# EasyEDA Pro project ProPrj_PEDRO.epro, schematic Schematic1

## Sheets
1 MCU: Board Name: Board1; Create Date: 2026-08-21; Page Name: MCU; Project Name: PEDRO; Schematic Name: Schematic1; Update Date: 2026-08-27; Company: 嘉立创EDA; Page Size: A3; Version: V1.0
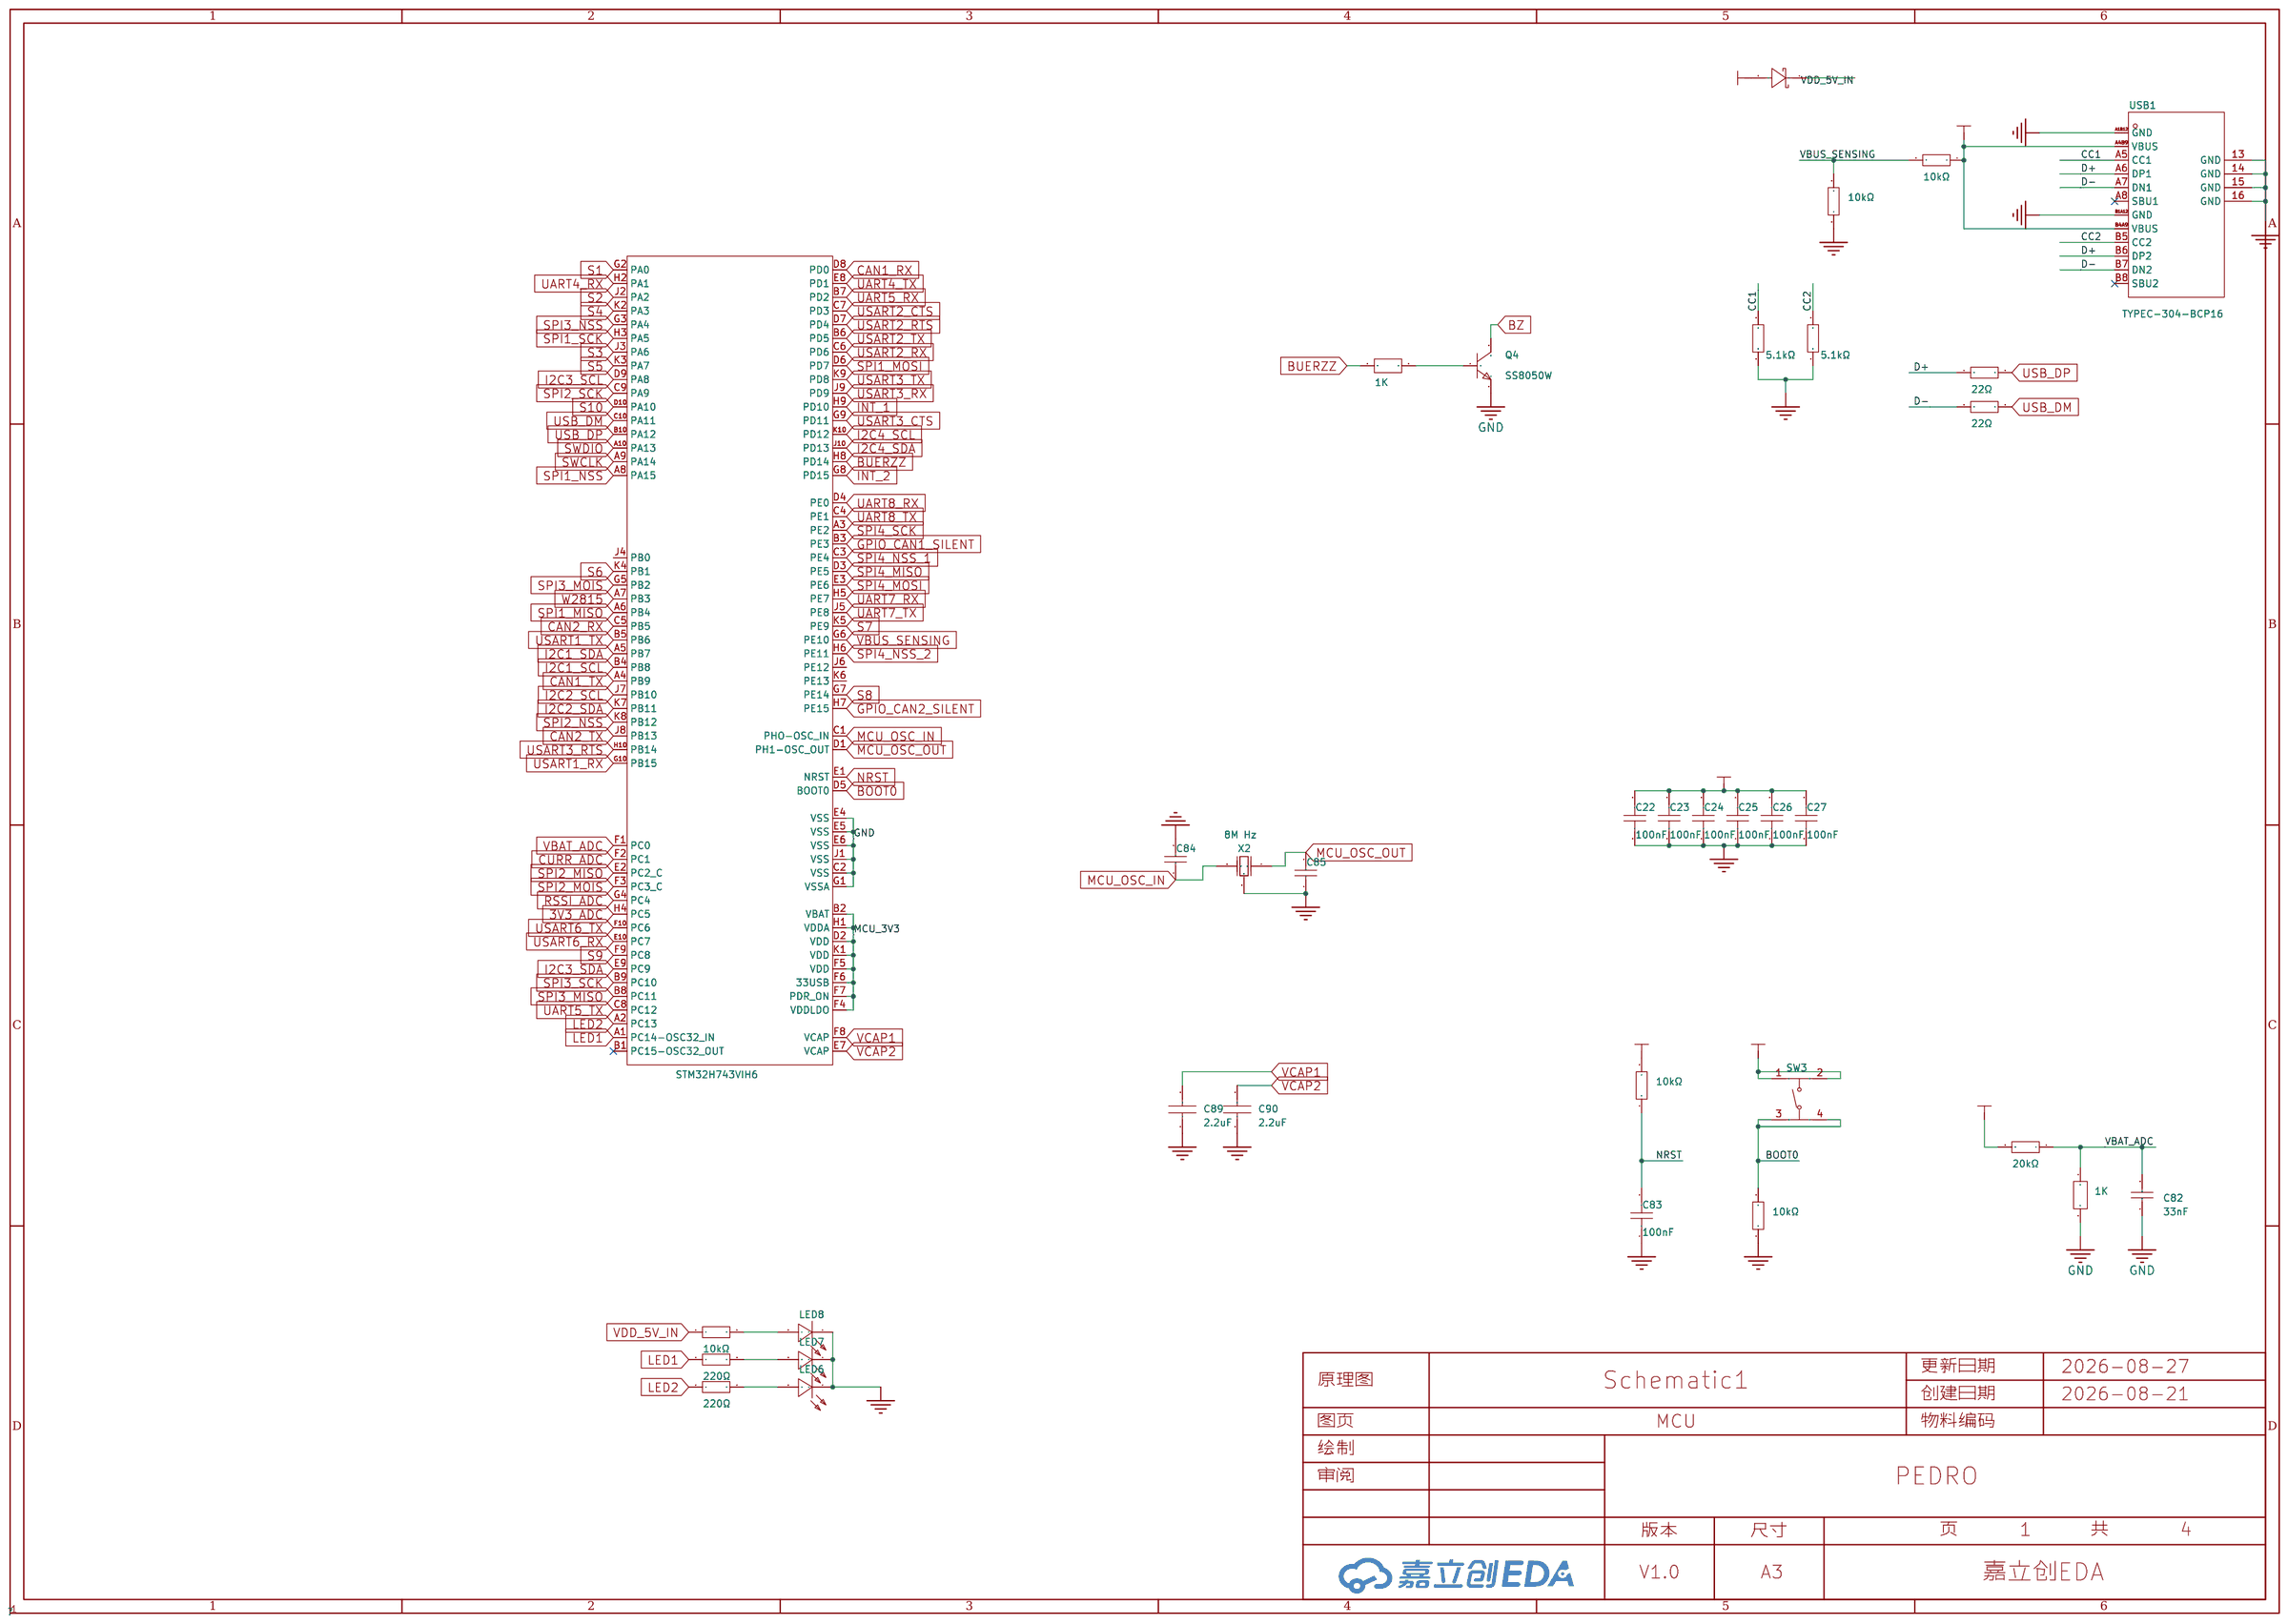
[diagram p0: MCU]
2 传感器: Create Date: 2026-08-22; Page Name: 传感器
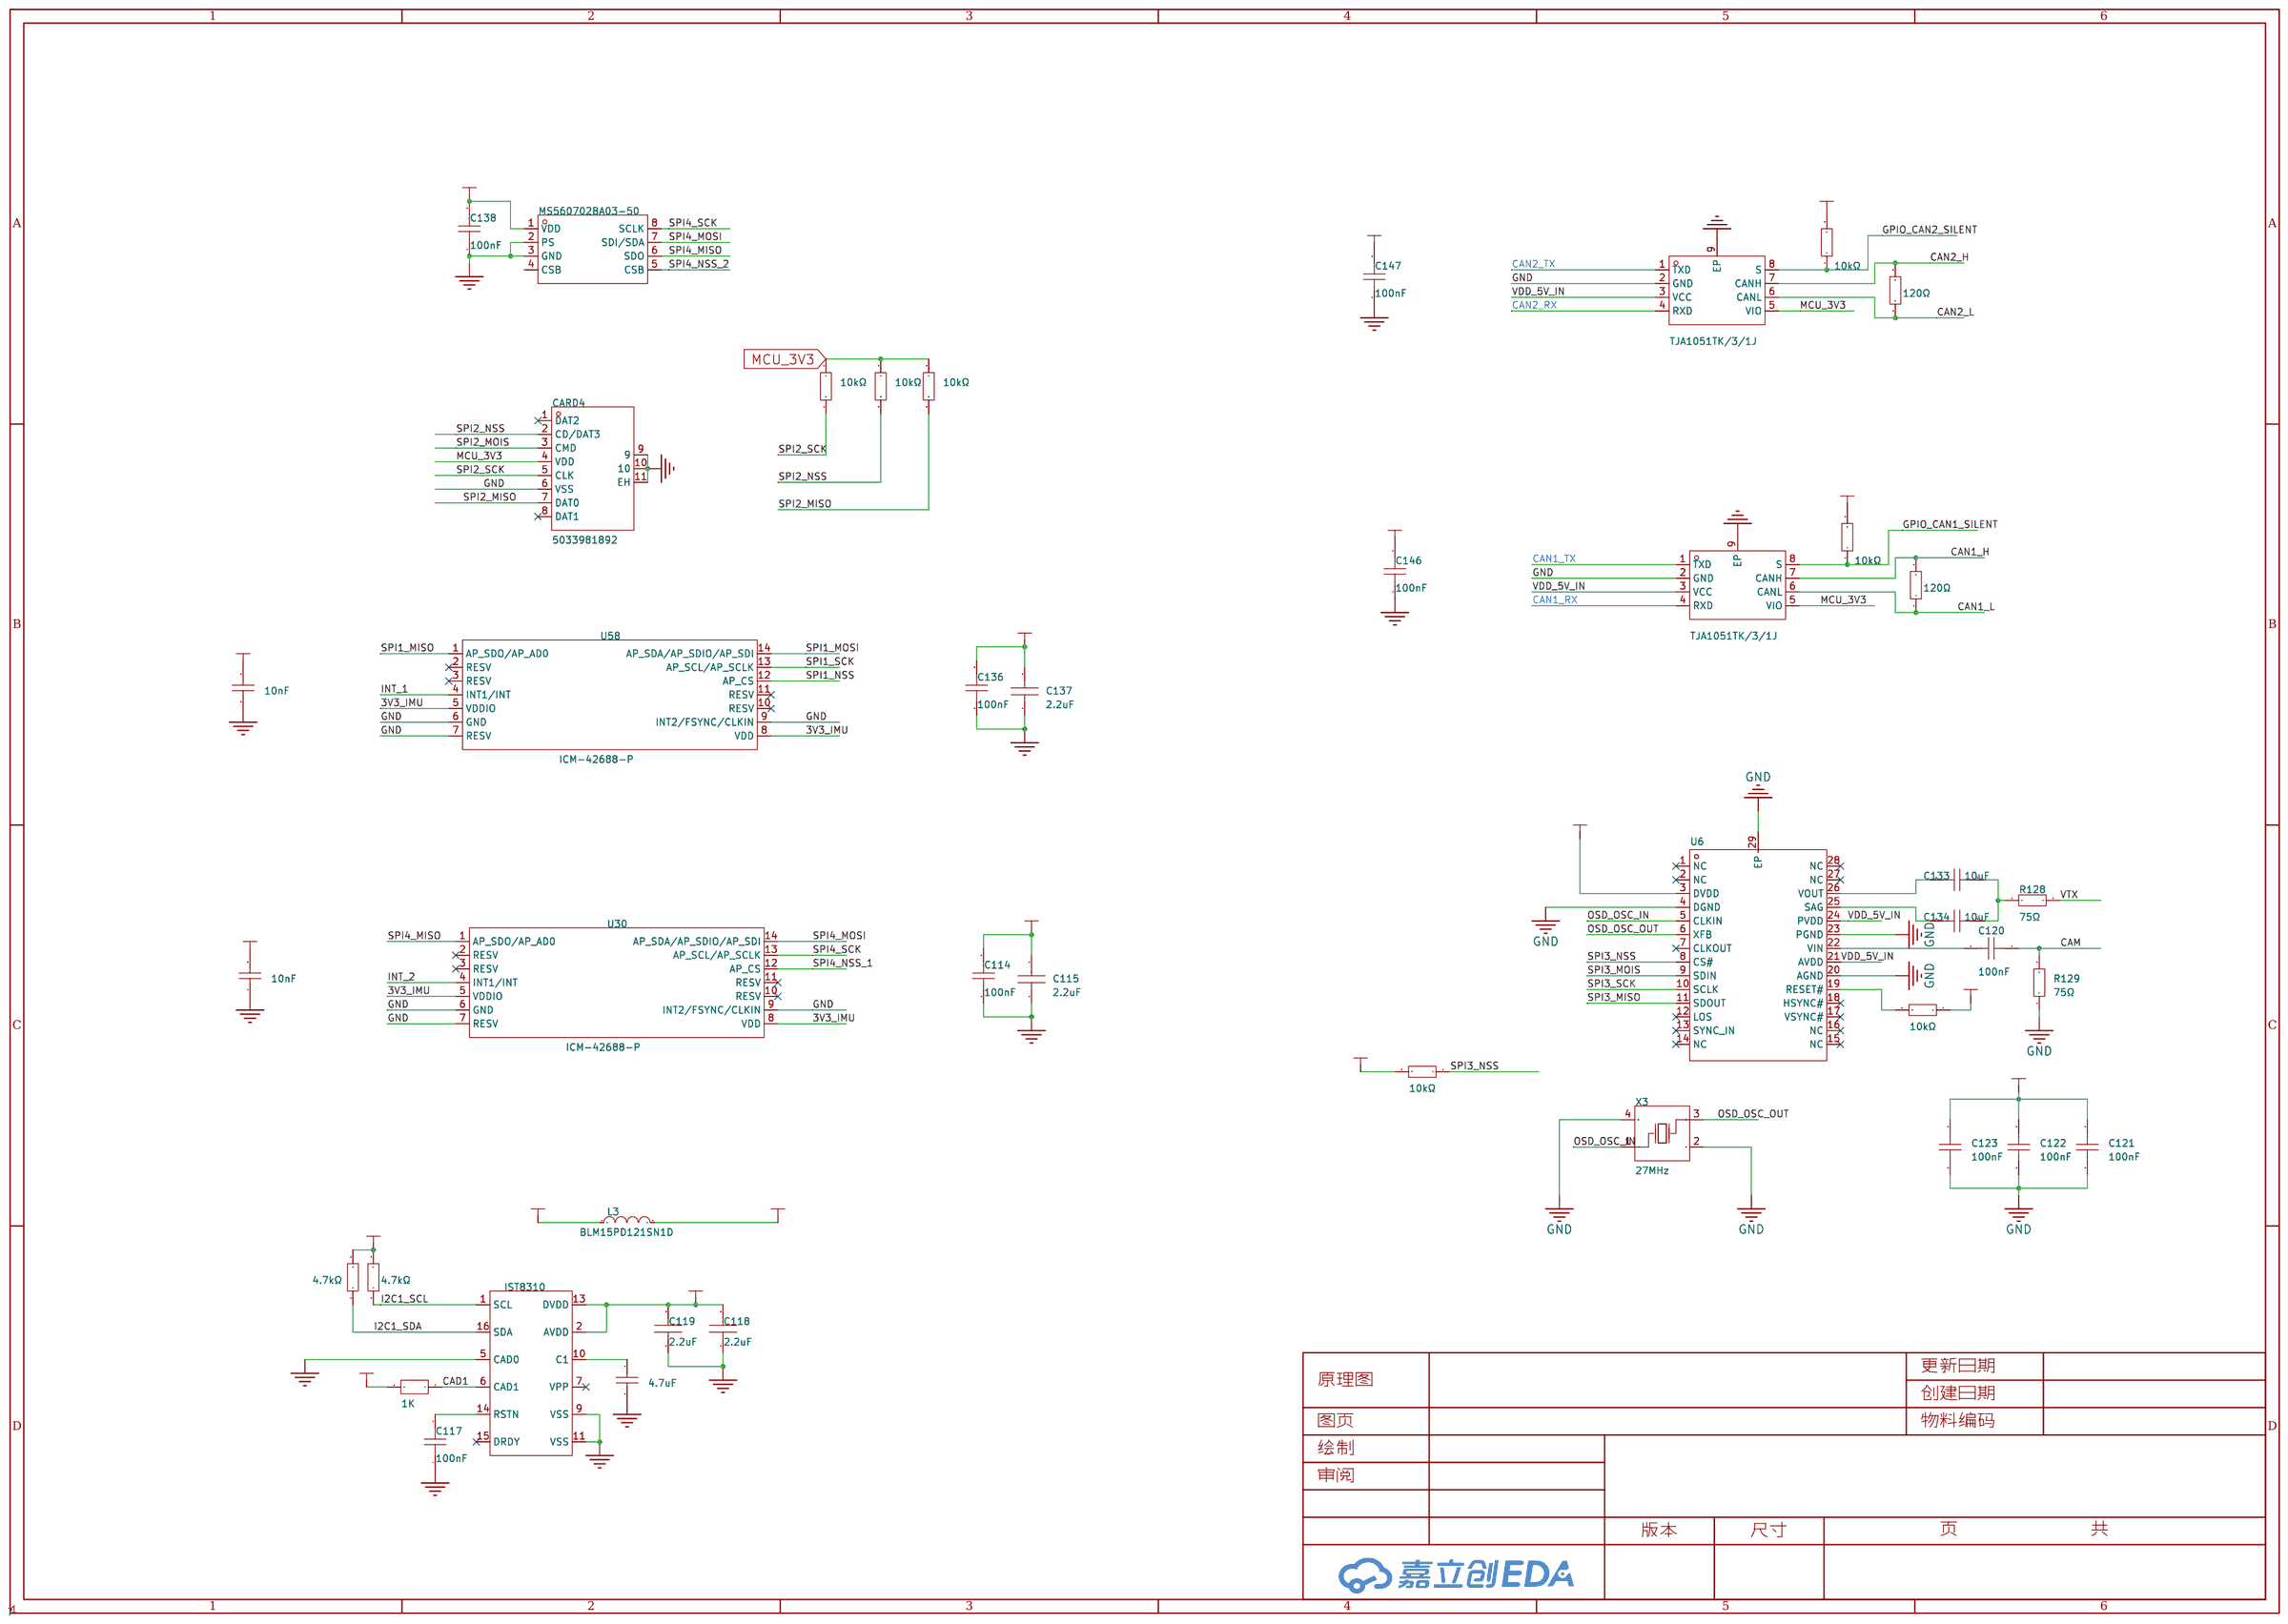
[diagram p1: 传感器]
3 供电: Page Name: 供电; Update Date: 2026-08-22
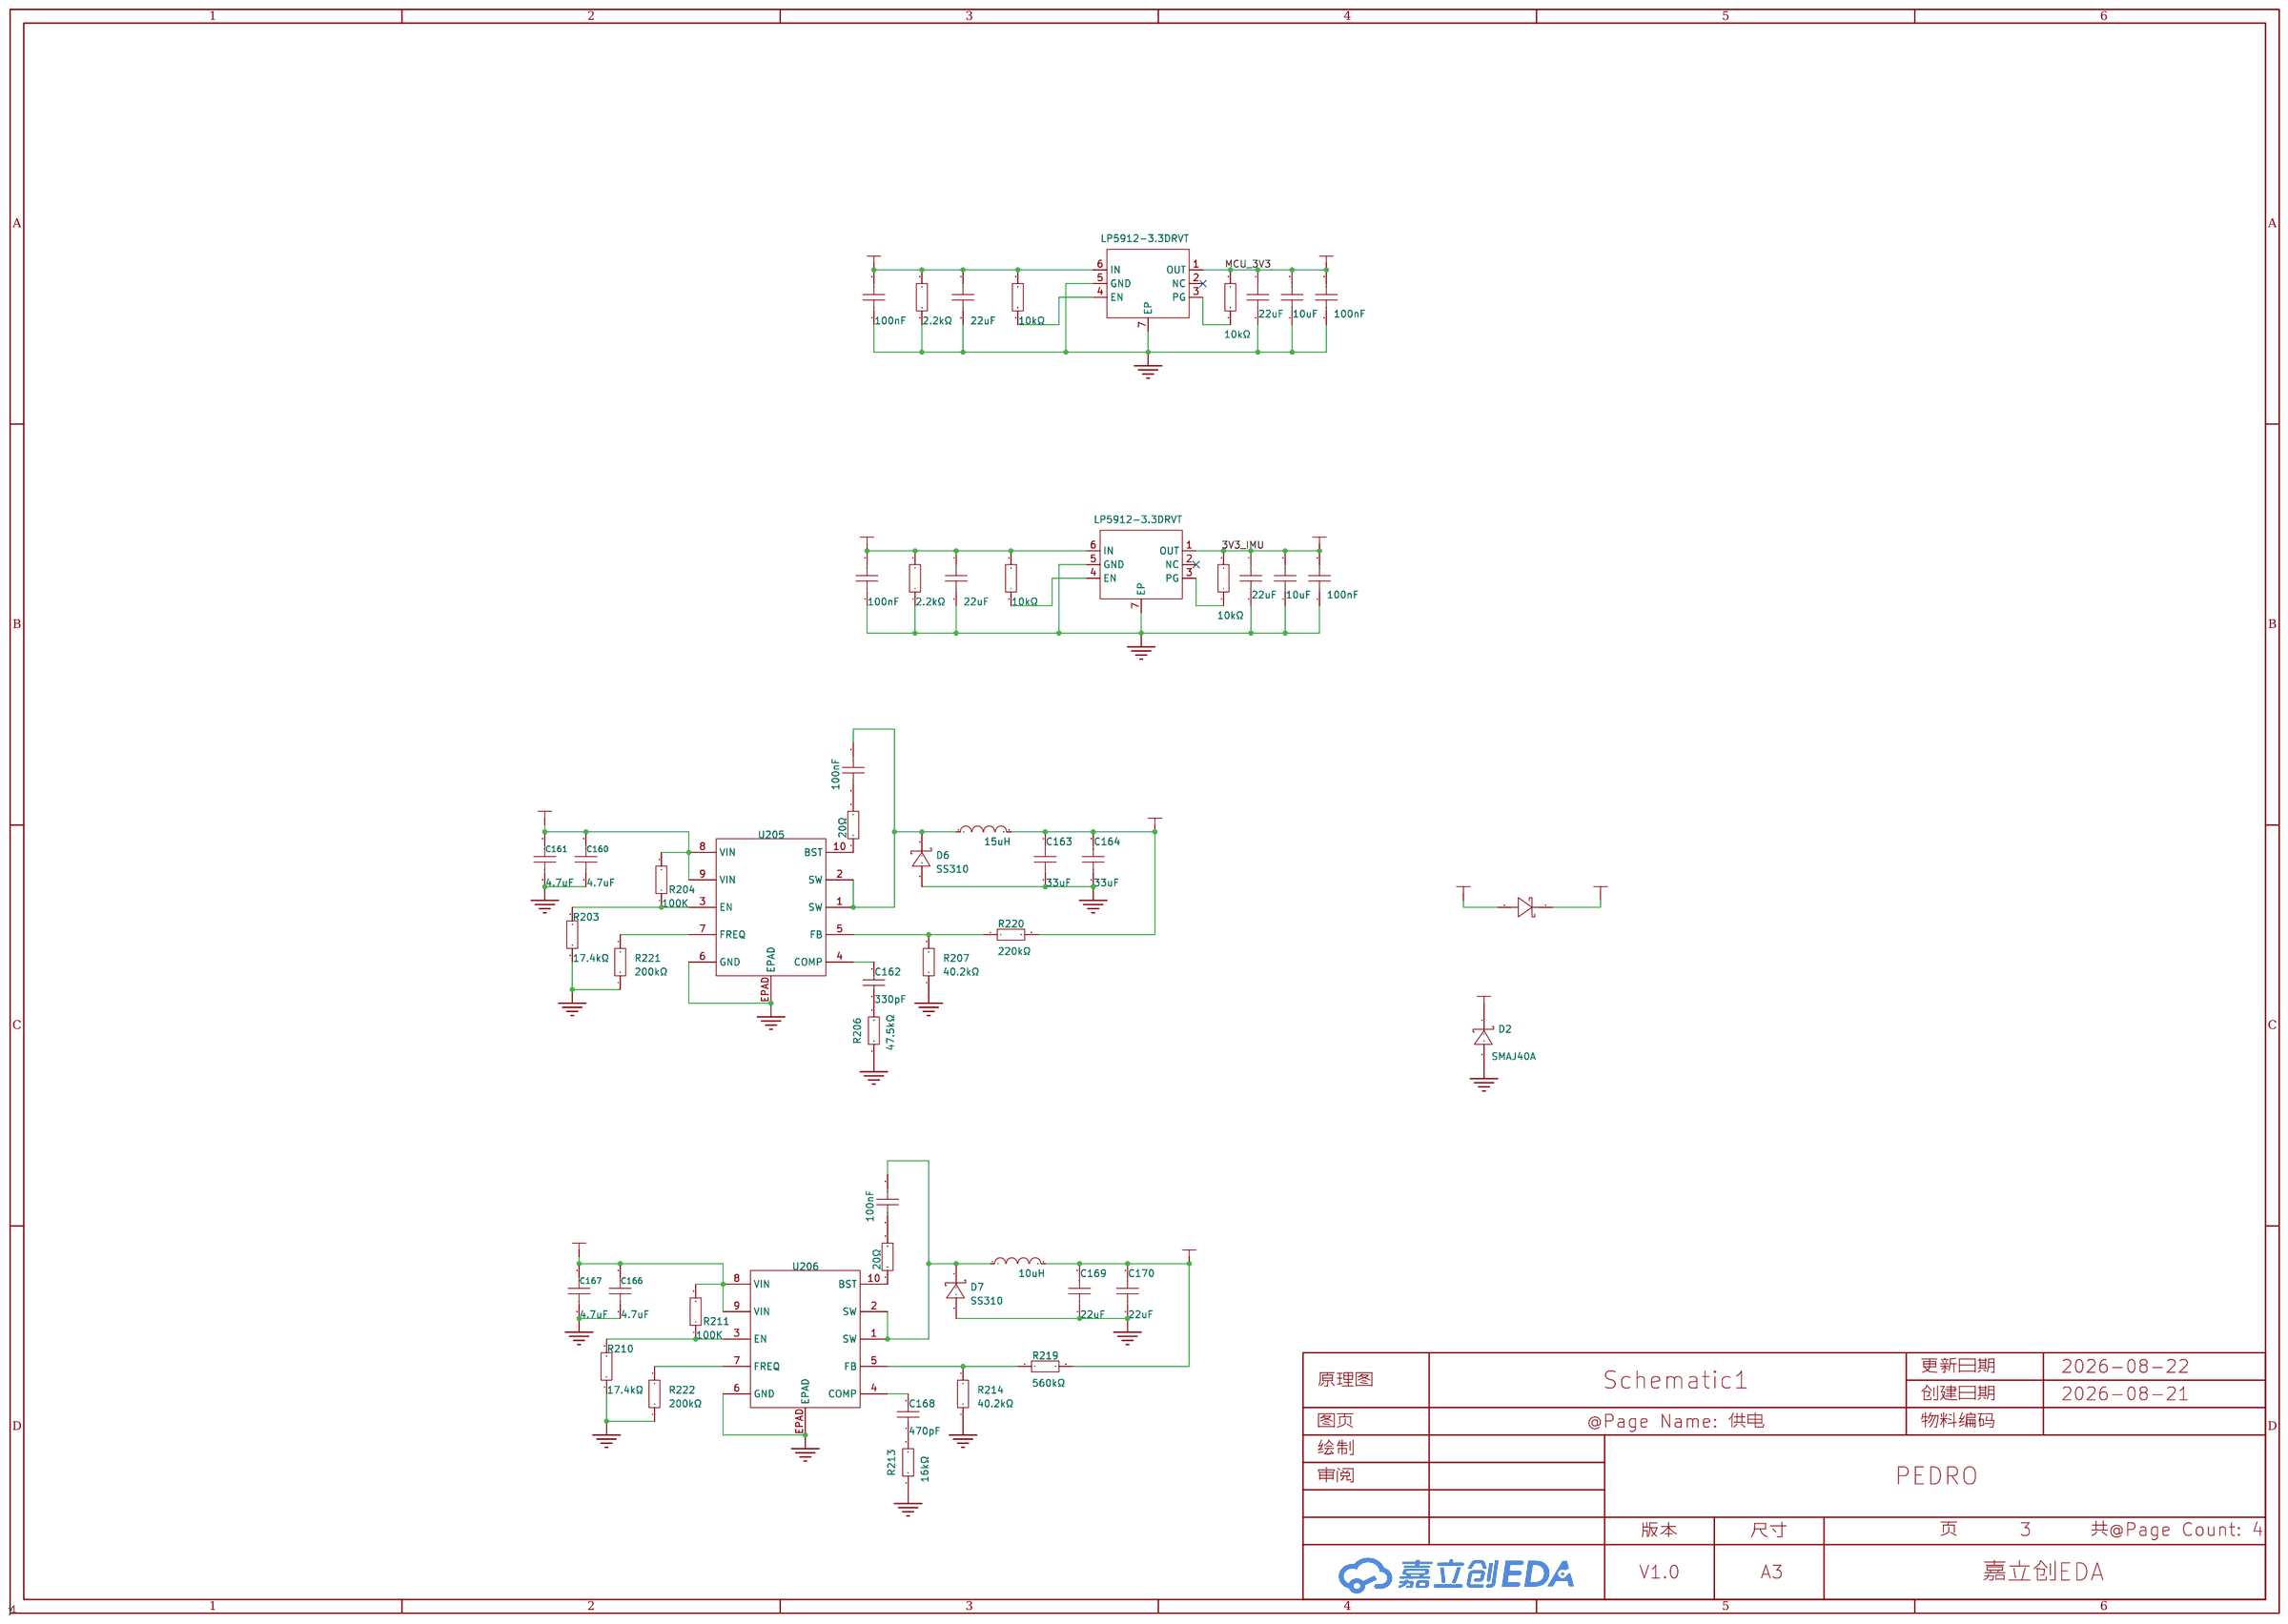
[diagram p2: 供电]
4 端口: Page Name: 端口; Update Date: 2026-08-22
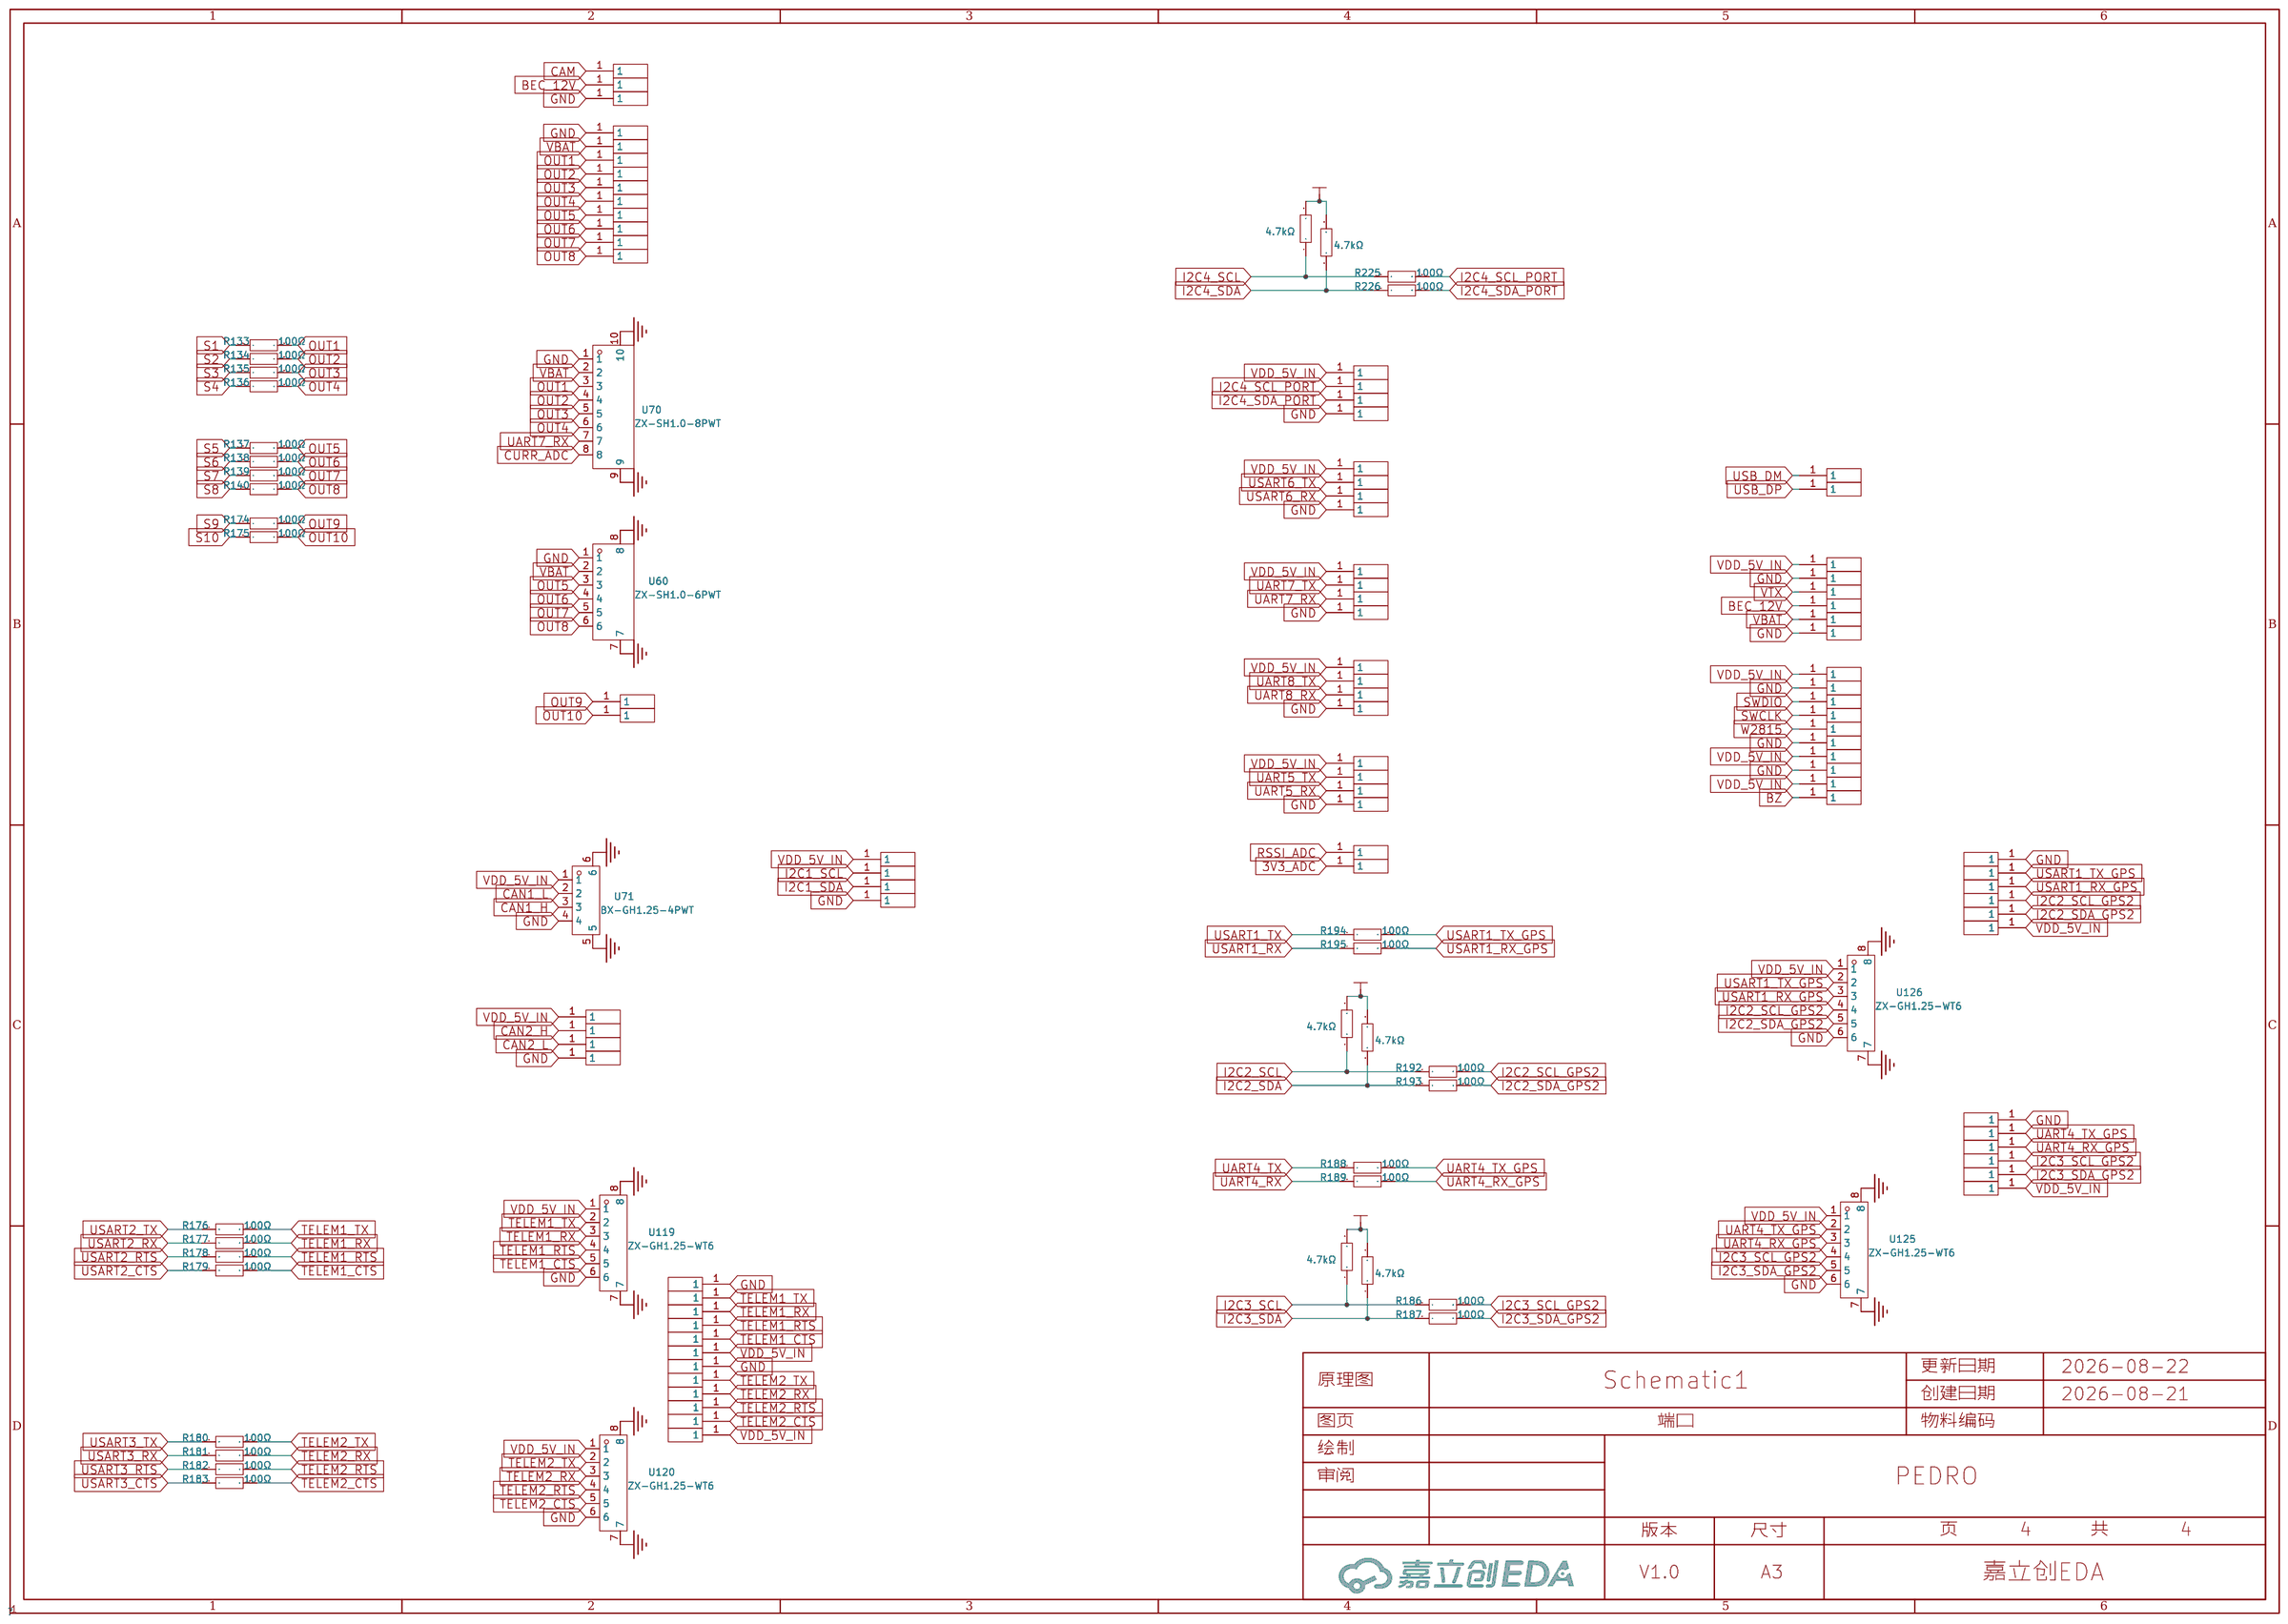
[diagram p3: 端口]

## Parts
sheet MCU
C22  100nF  [C0402]
C23  100nF  [C0402]
C24  100nF  [C0402]
C25  100nF  [C0402]
C26  100nF  [C0402]
C27  100nF  [C0402]
C82  33nF  [C0402]
C83  100nF  [C0402]
C84  12pF  [C0402]
C85  12pF  [C0402]
C89  2.2uF  [C0402]
C90  2.2uF  [C0402]
D4  DSK34  [SOD-123_L2.8-W1.8-LS3.7-RD]
LED6  NCD0402R1  [LED0402-RD]
LED7  NCD0402R1  [LED0402-RD]
LED8  NCD0402R1  [LED0402-RD]
Q4  SS8050W  [SOT-323-3_L2.1-W1.3-P1.30-LS2.3-BR]
R99  5.1kΩ  [R0402]
R100  5.1kΩ  [R0402]
R101  22Ω  [R0402]
R102  22Ω  [R0402]
R108  10kΩ  [R0402]
R109  10kΩ  [R0402]
R118  10kΩ  [R0402]
R119  10kΩ  [R0402]
R143  10kΩ  [R0402]
R170  20kΩ  [R0402]
R171  1K  [R0402]
R228  1K  [R0402]
R229  220Ω  [R0402]
R230  220Ω  [R0402]
SW3  TS-1089S-02526  [SW-SMD_4P-L4.2-W3.3-P2.15-LS5.1]
U65  STM32H743VIH6  [BGA-100_L8.0-W8.0-P0.80-R10-C10-BL]
USB1  TYPEC-304-BCP16  [USB-C-SMD_TYPEC-304-BCP16_2]
X2  8M Hz  [OSC-SMD_3P-L3.2-W1.3-P1.20-L]
sheet 传感器
C32  10nF  [C0402]
C102  4.7uF  [C0402]
C114  100nF  [C0402]
C115  2.2uF  [C0402]
C117  100nF  [C0402]
C118  2.2uF  [C0402]
C119  2.2uF  [C0402]
C120  100nF  [C0402]
C121  100nF  [C0402]
C122  100nF  [C0402]
C123  100nF  [C0402]
C133  10uF  [C0603]
C134  10uF  [C0603]
C135  10nF  [C0402]
C136  100nF  [C0402]
C137  2.2uF  [C0402]
C138  100nF  [C0402]
C146  100nF  [C0402]
C147  100nF  [C0402]
CARD4  5033981892  [TF-SMD_503398-1892]
L3  BLM15PD121SN1D  [L0402]
R56  120Ω  [R0402]
R76  4.7kΩ  [r0402]
R88  4.7kΩ  [r0402]
R110  10kΩ  [R0402]
R111  10kΩ  [R0402]
R126  1K  [R0402]
R128  75Ω  [R0402]
R129  75Ω  [R0402]
R130  10kΩ  [R0402]
R131  10kΩ  [R0402]
R172  120Ω  [R0402]
R173  10kΩ  [R0402]
R196  10kΩ  [R0402]
R227  10kΩ  [R0402]
U6  AT7456E  [TSSOP-28_L9.7-W4.4-P0.65-LS6.4-BL-EP-2]
U30  ICM-42688-P  [LGA-14_L3.0-W2.5-P0.50-TL]
U37  IST8310  [LGA-16_L3.0-W3.0-P0.5-BL]
U38  TJA1051TK/3/1J  [HVSON-8_L3.0-W3.0-P0.65-BL-EP]
U58  ICM-42688-P  [LGA-14_L3.0-W2.5-P0.50-TL]
U59  MS560702BA03-50  [SENSOR-SMD_MS560702BA03-50]
U67  TJA1051TK/3/1J  [HVSON-8_L3.0-W3.0-P0.65-BL-EP]
X3  27MHz  [CRYSTAL-SMD_4P-L2.0-W1.6-BL-A]
sheet 供电
C150  22uF  [C0603]
C151  10uF  [C0603]
C152  22uF  [C0603]
C153  100nF  [C0402]
C154  100nF  [C0402]
C155  100nF  [C0402]
C156  22uF  [C0603]
C157  10uF  [C0603]
C158  22uF  [C0603]
C159  100nF  [C0402]
C160  4.7uF  [C1206]
C161  4.7uF  [C1206]
C162  330pF  [C0402]
C163  33uF  [C1206]
C164  33uF  [C1206]
C165  100nF  [C0402]
C166  4.7uF  [C1206]
C167  4.7uF  [C1206]
C168  470pF  [C0402]
C169  22uF  [C1206]
C170  22uF  [C1206]
C171  100nF  [C0402]
D2  SMAJ40A  [SMA_L4.4-W2.6-LS5.0-RD]
D5  DSK34  [SOD-123_L2.8-W1.8-LS3.7-RD]
D6  SS310  [SMA_L4.3-W2.6-LS5.2-RD]
D7  SS310  [SMA_L4.3-W2.6-LS5.2-RD]
L8  15uH  [IND-SMD_L4.4-W4.2]
L9  10uH  [IND-SMD_L4.4-W4.2]
R197  2.2kΩ  [R0402]
R198  10kΩ  [R0402]
R199  10kΩ  [R0402]
R200  2.2kΩ  [R0402]
R201  10kΩ  [R0402]
R202  10kΩ  [R0402]
R203  17.4kΩ  [R0402]
R204  100K  [R0402]
R206  47.5kΩ  [R0402]
R207  40.2kΩ  [R0402]
R209  20Ω  [R0402]
R210  17.4kΩ  [R0402]
R211  100K  [R0402]
R213  16kΩ  [R0402]
R214  40.2kΩ  [R0402]
R216  20Ω  [R0402]
R219  560kΩ  [R0402]
R220  220kΩ  [R0402]
R221  200kΩ  [R0402]
R222  200kΩ  [R0402]
U98  LP5912-3.3DRVT  [WSON-6_L2.0-W2.0-P0.65-TL-EP]
U204  LP5912-3.3DRVT  [WSON-6_L2.0-W2.0-P0.65-TL-EP]
U205  -  [MP4560DQ]
U206  -  [MP4560DQ]
sheet 端口
R133  100Ω  [R0402]
R134  100Ω  [R0402]
R135  100Ω  [R0402]
R136  100Ω  [R0402]
R137  100Ω  [R0402]
R138  100Ω  [R0402]
R139  100Ω  [R0402]
R140  100Ω  [R0402]
R174  100Ω  [R0402]
R175  100Ω  [R0402]
R176  100Ω  [R0402]
R177  100Ω  [R0402]
R178  100Ω  [R0402]
R179  100Ω  [R0402]
R180  100Ω  [R0402]
R181  100Ω  [R0402]
R182  100Ω  [R0402]
R183  100Ω  [R0402]
R184  4.7kΩ  [r0402]
R185  4.7kΩ  [r0402]
R186  100Ω  [R0402]
R187  100Ω  [R0402]
R188  100Ω  [R0402]
R189  100Ω  [R0402]
R190  4.7kΩ  [r0402]
R191  4.7kΩ  [r0402]
R192  100Ω  [R0402]
R193  100Ω  [R0402]
R194  100Ω  [R0402]
R195  100Ω  [R0402]
R223  4.7kΩ  [r0402]
R224  4.7kΩ  [r0402]
R225  100Ω  [R0402]
R226  100Ω  [R0402]
U60  ZX-SH1.0-6PWT  [CONN-SMD_6P-P1.00_MEGASTAR_ZX-SH1.0-6PWT]
U70  ZX-SH1.0-8PWT  [CONN-SMD_8P-P1.00_MEGASTAR_ZX-SH1.0-8PWT]
U71  BX-GH1.25-4PWT  [CONN-SMD_4P-P1.25_BX-GH1.25-4PWT]
U106  -  [焊盘1.3]
U114  -  [焊盘1.3]
U115  -  [焊盘1.3]
U116  -  [焊盘1.3]
U117  -  [焊盘1.3]
U118  -  [焊盘1.3]
U119  ZX-GH1.25-WT6  [CONN-SMD_6P-P1.25_ZX-GH1.25-WT6]
U120  ZX-GH1.25-WT6  [CONN-SMD_6P-P1.25_ZX-GH1.25-WT6]
U121  -  [焊盘1.3]
U122  -  [焊盘1.3]
U123  -  [焊盘1.3]
U124  -  [焊盘1.3]
U125  ZX-GH1.25-WT6  [CONN-SMD_6P-P1.25_ZX-GH1.25-WT6]
U126  ZX-GH1.25-WT6  [CONN-SMD_6P-P1.25_ZX-GH1.25-WT6]
U127  -  [焊盘1.3]
U128  -  [焊盘1.3]
U129  -  [焊盘1.3]
U130  -  [焊盘1.3]
U131  -  [焊盘1.3]
U132  -  [焊盘1.3]
U133  -  [焊盘1.3]
U134  -  [焊盘1.3]
U135  -  [焊盘1.3]
U136  -  [焊盘1.3]
U137  -  [焊盘1.3]
U138  -  [焊盘1.3]
U139  -  [焊盘1.3]
U140  -  [焊盘1.3]
U141  -  [焊盘1.3]
U142  -  [焊盘1.3]
U143  -  [焊盘1.3]
U144  -  [焊盘1.3]
U145  -  [焊盘1.3]
U146  -  [焊盘1.3]
U147  -  [焊盘1.3]
U148  -  [焊盘1.3]
U149  -  [焊盘1.3]
U150  -  [焊盘1.3]
U151  -  [焊盘1.3]
U152  -  [焊盘1.3]
U153  -  [焊盘1.3]
U154  -  [焊盘1.3]
U155  -  [焊盘1.3]
U156  -  [焊盘1.3]
U157  -  [焊盘1.3]
U158  -  [焊盘1.3]
U159  -  [焊盘1.3]
U160  -  [焊盘1.3]
U161  -  [焊盘1.3]
U162  -  [焊盘1.3]
U163  -  [焊盘1.3]
U164  -  [焊盘1.3]
U165  -  [焊盘1.3]
U166  -  [焊盘1.3]
U167  -  [焊盘1.3]
U168  -  [焊盘1.3]
U169  -  [焊盘1.3]
U170  -  [焊盘1.3]
U171  -  [焊盘1.3]
U172  -  [焊盘1.3]
U173  -  [焊盘1.3]
U174  -  [焊盘1.3]
U175  -  [焊盘1.3]
U176  -  [焊盘1.3]
U177  -  [焊盘1.3]
U178  -  [焊盘1.3]
U179  -  [焊盘1.3]
U180  -  [焊盘1.3]
U181  -  [焊盘1.3]
U182  -  [焊盘1.3]
U183  -  [焊盘1.3]
U184  -  [焊盘1.3]
U185  -  [焊盘1.3]
U186  -  [焊盘1.3]
U187  -  [焊盘1.3]
U188  -  [焊盘1.3]
U189  -  [焊盘1.3]
U190  -  [焊盘1.3]
U191  -  [焊盘1.3]
U192  -  [焊盘1.3]
U193  -  [焊盘1.3]
U194  -  [焊盘1.3]
U195  -  [焊盘1.3]
U196  -  [焊盘1.3]
U197  -  [焊盘1.3]
U198  -  [焊盘1.3]
U199  -  [焊盘1.3]
U200  -  [焊盘1.3]
U201  -  [焊盘1.3]
U202  -  [焊盘1.3]
U203  -  [焊盘1.3]

## Library data of the parts
C22-C27 C83 C114 C117 C120-C123 C136 C138 C146 C147 = CC0402KRX7R7BB104: 容值:100nF;精度:±10%;额定电压:16V;材质(温度系数):X7R;; LCSC Part Name: 100nF ±10% 16V; Supplier Part: C60474; Manufacturer: YAGEO(国巨); Supplier Footprint: 0402; JLCPCB Part Class: 扩展库; Datasheet: https://atta.szlcsc.com/upload/public/pdf/source/20211223/9278FD768280B81DDBEF48FA36411A03.pdf; Supplier: LCSC; Tolerance: ±10%; Voltage Rated: 16V; Temperature Coefficient: X7R
C82 = CC0402KRX7R9BB333: 容值:33nF;精度:±10%;额定电压:50V;材质(温度系数):X7R;; LCSC Part Name: 33nF ±10% 50V; Supplier Part: C106862; Manufacturer: YAGEO(国巨); Supplier Footprint: 0402; JLCPCB Part Class: 扩展库; Datasheet: https://atta.szlcsc.com/upload/public/pdf/source/20170919/C131031_1505787245477976978.pdf; Supplier: LCSC; Tolerance: ±10%; Voltage Rated: 50V; Temperature Coefficient: X7R
C84 C85 = 0402CG120J500NT: 容值:12pF;精度:±5%;额定电压:50V;材质(温度系数):C0G;; LCSC Part Name: 12pF ±5% 50V; Supplier Part: C1547; Manufacturer: FH(风华); Supplier Footprint: 0402; JLCPCB Part Class: 基础库; Datasheet: https://atta.szlcsc.com/upload/public/pdf/source/20200305/C486355_26A10D38EF8C2A5C37091D0039909270.pdf; Supplier: LCSC; Tolerance: ±5%; Voltage Rated: 50V; Temperature Coefficient: C0G
C89 C90 C115 C118 C119 C137 = CL05A225MQ5NSNC: 容值:2.2uF;精度:±20%;额定电压:6.3V;材质(温度系数):X5R;; LCSC Part Name: 2.2uF ±20% 6.3V; Supplier Part: C12530; Manufacturer: SAMSUNG(三星); Supplier Footprint: 0402; JLCPCB Part Class: Basic Part; Datasheet: https://atta.szlcsc.com/upload/public/pdf/source/20160218/1457707763339.pdf; Supplier: LCSC; Tolerance: ±20%; Voltage Rated: 6.3V; Temperature Coefficient: X5R
D4 D5 = DSK34: 二极管配置:-;正向压降(Vf):550mV@3A;直流反向耐压(Vr):40V;平均整流电流(Io):3A;; LCSC Part Name: 电压:40V 电流:3A; Supplier Part: C908230; Manufacturer: FUXINSEMI(富芯森美); Supplier Footprint: SOD-123; JLCPCB Part Class: 扩展库; Datasheet: https://atta.szlcsc.com/upload/public/pdf/source/20201027/C908230_5B73A4E0F076D2A690D7C134AB43D23C.pdf; Supplier: LCSC; Forward Voltage (Vf@If): 550mV@3A; Reverse Voltage (Vr): 40V; Average Rectified Current (Io): 3A; Reverse Leakage Current (Ir): 500nA
LED6-LED8 = NCD0402R1: 发光颜色:红色;正向电压(VF):1.6V~2.6V;功率:65mW;正向电流:5mA;主波长:615nm~635nm;透镜颜色:无色透明透镜;发光强度:13mcd~30mcd;发光角度:130°;工作温度:-30℃~+85℃;; Supplier Part: C130719; Manufacturer: 国星光电; Supplier Footprint: 0402; JLCPCB Part Class: 扩展库; Datasheet: https://atta.szlcsc.com/upload/public/pdf/source/20200820/C130719_A72EA5A7FEC83C35856EA0453E4EE775.pdf; Supplier: LCSC; Emitted Color: 红色; Forward Voltage (VF): 1.6V~2.6V; Power Dissipation: 65mW; Forward Current: 5mA; Dominant Wavelength: 615nm~635nm; Lens Color: 无色透明透镜; Luminous Intensity: 13mcd~30mcd; Viewing Angle: 130°; Operating Temperature: -30℃~+85℃
Q4 = SS8050W_C2836073: 晶体管类型:-;集电极电流(Ic):-;集射极击穿电压(Vceo):-;功率(Pd):-;; LCSC Part Name: SS8050W Y1(Y1表示丝印); Supplier Part: C2836073; Manufacturer: CBI(创基); Supplier Footprint: SOT-323-3; JLCPCB Part Class: 扩展库; Datasheet: https://atta.szlcsc.com/upload/public/pdf/source/20210603/C2836073_5EFBD6CEC895A378A6EEE893C4C8D798.pdf; Supplier: LCSC
R99 R100 = 0402WGF5101TCE: 电阻类型:厚膜电阻;阻值:5.1kΩ;精度:±1%;功率:62.5mW;最大工作电压:50V;温度系数:±100ppm/℃;; LCSC Part Name: 5.1kΩ ±1% 62.5mW 厚膜电阻; Supplier Part: C25905; Manufacturer: UNI-ROYAL(厚声); Supplier Footprint: 0402; JLCPCB Part Class: 基础库; Datasheet: https://atta.szlcsc.com/upload/public/pdf/source/20200306/C422600_1E6D84923E4A46A82E41ADD87F860B5C.pdf; Supplier: LCSC; Type: 厚膜电阻; Tolerance: ±1%; Power(Watts): 62.5mW; Overload Voltage (Max): 50V; Temperature Coefficient: ±100ppm/℃; Operating Temperature Range: -55℃~+155℃
R101 R102 = 0402WGF220JTCE: 电阻类型:厚膜电阻;阻值:22Ω;精度:±1%;功率:62.5mW;最大工作电压:50V;温度系数:±100ppm/℃;; LCSC Part Name: 22Ω ±1% 62.5mW 厚膜电阻; Supplier Part: C25092; Manufacturer: UNI-ROYAL(厚声); Supplier Footprint: 0402; JLCPCB Part Class: 基础库; Datasheet: https://atta.szlcsc.com/upload/public/pdf/source/20200306/C422600_1E6D84923E4A46A82E41ADD87F860B5C.pdf; Supplier: LCSC; Type: 厚膜电阻; Tolerance: ±1%; Power(Watts): 62.5mW; Overload Voltage (Max): 50V; Temperature Coefficient: ±100ppm/℃; Operating Temperature Range: -55℃~+155℃
R108 R109 R118 R119 R130 R131 R143 R170 = RC0402FR-0710KL: 电阻类型:厚膜电阻;阻值:10kΩ;精度:±1%;功率:62.5mW;最大工作电压:50V;温度系数:±100ppm/℃;; LCSC Part Name: 厚膜电阻 10kΩ ±1% 62.5mW; Supplier Part: C60490; Manufacturer: YAGEO(国巨); Supplier Footprint: 0402; JLCPCB Part Class: Extended Part; Datasheet: https://atta.szlcsc.com/upload/public/pdf/source/20170925/C131467_1506321478108990263.pdf; Supplier: LCSC; Type: 厚膜电阻; Tolerance: ±1%; Power(Watts): 62.5mW; Overload Voltage (Max): 50V; Temperature Coefficient: ±100ppm/℃; Operating Temperature Range: -55℃~+155℃
R126 R171 R228 = ERJPA2F22R0X: 电阻类型:厚膜电阻;阻值:22Ω;精度:±1%;功率:200mW;温度系数:±100ppm/℃;最大工作电压:-;工作温度范围:-55℃~+155℃;; LCSC Part Name: 22Ω ±1% 200mW; Supplier Part: C3152067; Manufacturer: PANASONIC(松下); Supplier Footprint: 0402; JLCPCB Part Class: 扩展库; Supplier: LCSC; Type: 厚膜电阻; Tolerance: ±1%; Power(Watts): 200mW; Temperature Coefficient: ±100ppm/℃; Operating Temperature Range: -55℃~+155℃
R229 R230 = 0402WGF2200TCE: 电阻类型:厚膜电阻;阻值:220Ω;精度:±1%;功率:62.5mW;最大工作电压:50V;温度系数:±100ppm/℃;; LCSC Part Name: 220Ω ±1% 62.5mW 厚膜电阻; Supplier Part: C25091; Manufacturer: UNI-ROYAL(厚声); Supplier Footprint: 0402; JLCPCB Part Class: 基础库; Datasheet: https://atta.szlcsc.com/upload/public/pdf/source/20200306/C422600_1E6D84923E4A46A82E41ADD87F860B5C.pdf; Supplier: LCSC; Type: 厚膜电阻; Tolerance: ±1%; Power(Watts): 62.5mW; Overload Voltage (Max): 50V; Temperature Coefficient: ±100ppm/℃; Operating Temperature Range: -55℃~+155℃
SW3 = TS-1089S-02526: 电路结构:单刀单掷;按钮形状:椭圆形按钮;安装方式:立贴;开关长度:4.2mm;开关宽度:3.25mm;开关高度:2.5mm;触点电流:50mA;额定电压(DC):12V;带灯:-;机械寿命:-;; LCSC Part Name: 4.2*3.25*2.5mm 立贴 轻触开关; Supplier Part: C455282; Manufacturer: XUNPU(讯普); Supplier Footprint: SMD,3.3x4.2mm; JLCPCB Part Class: 扩展库; Datasheet: https://atta.szlcsc.com/upload/public/pdf/source/20191118/C455282_2E86A26A9CC4FEF4662951C4D45ED672.pdf; Supplier: LCSC; Circuit: 单刀单掷; Actuator Style: 椭圆形按钮; Mounting Style: 立贴; Switch Length: 4.2mm; Switch Width: 3.25mm; Switch Height: 2.5mm; Contact Current: 50mA; Voltage Rating (DC): 12V
U65 = STM32H743VIH6: 32位Arm Cortex -M7 480MHz mcu,高达2MB的Flash,高达1MB的RAM,46com和模拟接口; Supplier: LCSC; Supplier Part: C964146; Manufacturer: ST(意法半导体); Supplier Footprint: TFBGA-100; Datasheet: https://atta.szlcsc.com/upload/public/pdf/source/20220307/46489B78091107FB73FE6602EFA9948C.pdf
USB1 = TYPEC-304-BCP16_C720629_1: 连接器类型:Type-C;标准:USB 3.1;公母:母座;触点数量:16;端口数量:1;安装方式:卧贴;额定电流 - 电源:3A;工作温度范围:-25℃~+85℃;焊接温度(最大值):260℃;; LCSC Part Name: Type-C 母座 卧贴 停产 停产; Supplier Part: C2909610; Manufacturer: XUNPU(讯普); Supplier Footprint: SMD; JLCPCB Part Class: 扩展库; Datasheet: https://atta.szlcsc.com/upload/public/pdf/source/20220210/1FE0FEFF7D6A20C111212527D3DED014.pdf; Supplier: LCSC; Connector Type: Type-C; Standard: USB 3.1; Gender: 母座; Number of Contacts: 16; Number of Ports: 1; Mounting Style: 卧贴; Current Rating - Power (Max): 3A; Operating Temperature Range: -25℃~+85℃; Welding Temperature (Max): 260℃
X2 = CSTNE8M00GH5C000R0: LCSC Part Name: 8MHz ±0.07% 33pF; Supplier Part: C341525; Manufacturer: muRata(村田); Supplier Footprint: SMD; JLCPCB Part Class: 扩展库; Datasheet: https://atta.szlcsc.com/upload/public/pdf/source/20181211/C341525_832BA077079E4863A5153C1DB98581D5.pdf; Supplier: LCSC
C32 C135 = CC0402KRX7R9BB103: 容值:10nF;精度:±10%;额定电压:50V;材质(温度系数):X7R;; LCSC Part Name: 10nF ±10% 50V; Supplier Part: C60133; Manufacturer: YAGEO(国巨); Supplier Footprint: 0402; JLCPCB Part Class: Extended Part; Datasheet: https://atta.szlcsc.com/upload/public/pdf/source/20151201/1457707601869.pdf; Supplier: LCSC; Tolerance: ±10%; Voltage Rated: 50V; Temperature Coefficient: X7R
C102 = CL05A475MP5NRNC: 容值:4.7uF;精度:±20%;额定电压:10V;材质(温度系数):X5R;; LCSC Part Name: 4.7uF ±20% 10V; Supplier Part: C23733; Manufacturer: SAMSUNG(三星); Supplier Footprint: 0402; JLCPCB Part Class: 基础库; Datasheet: https://atta.szlcsc.com/upload/public/pdf/source/20160218/1457707763339.pdf; Supplier: LCSC; Tolerance: ±20%; Voltage Rated: 10V; Temperature Coefficient: X5R
C133 C134 = CL10A106KP8NNNC: 容值:10uF;精度:±10%;额定电压:10V;材质(温度系数):X5R;; LCSC Part Name: 10uF ±10% 10V; Supplier Part: C19702; Manufacturer: SAMSUNG(三星); Supplier Footprint: 0603; JLCPCB Part Class: 基础库; Datasheet: https://atta.szlcsc.com/upload/public/pdf/source/20160218/1457707763339.pdf; Supplier: LCSC; Tolerance: ±10%; Voltage Rated: 10V; Temperature Coefficient: X5R
CARD4 = 5033981892: 卡连接方式:自弹式;卡类型:MicroSD卡(TF卡);连接器类型:卡座;本体最大高度:1.28mm;触头镀层:金;工作温度范围:-25℃~+85℃;; LCSC Part Name: 自弹式 MicroSD卡(TF卡) 卡座; Supplier Part: C428492; Manufacturer: MOLEX; Supplier Footprint: SMD; JLCPCB Part Class: 扩展库; Datasheet: https://atta.szlcsc.com/upload/public/pdf/source/20190912/C428492_A41EF83BB8A3DB8C0B39EF65DFC54013.pdf; Supplier: LCSC; Card Connection Mode: 自弹式; Card Type: MicroSD卡(TF卡); Connector Type: 卡座; Maximum Body Height: 1.28mm; Contact Plating: 金; Operating Temperature Range: -25℃~+85℃
L3 = BLM15PD121SN1D: 标称阻抗@测试频率:120Ω@100MHz;误差:±25%;直流电阻(RDC):90mΩ;; LCSC Part Name: 单路 0402磁珠 阻抗120Ω@100MHz; Supplier Part: C76891; Manufacturer: muRata(村田); Supplier Footprint: 0402; JLCPCB Part Class: 扩展库; Datasheet: https://atta.szlcsc.com/upload/public/pdf/source/20181120/C333978_3E581FB55966932B05020139ABDE8E01.pdf; Supplier: LCSC; Impedance @ Frequency: 120Ω@100MHz; Tolerance: ±25%; DC Resistance: 90mΩ; Current Rating: 1.3A; Circuits: 1
R56 R172 = 0402WGF1200TCE: 电阻类型:厚膜电阻;阻值:120Ω;精度:±1%;功率:62.5mW;; LCSC Part Name: 120Ω ±1% 62.5mW; Supplier Part: C25079; Manufacturer: UNI-ROYAL(厚声); Supplier Footprint: 0402; JLCPCB Part Class: Basic Part; Datasheet: https://atta.szlcsc.com/upload/public/pdf/source/20200306/C422600_1E6D84923E4A46A82E41ADD87F860B5C.pdf; Supplier: LCSC; Type: 厚膜电阻; Tolerance: ±1%; Power(Watts): 62.5mW; Temperature Coefficient: ±100ppm/; Overload Voltage (Max): 50V; Operating Temperature Range: -55~+155
R76 R88 R184 R185 R190 R191 R223 R224 = 0402WGF4701TCE: 电阻类型:厚膜电阻;阻值:4.7kΩ;精度:±1%;功率:62.5mW;最大工作电压:50V;温度系数:±100ppm/℃;; LCSC Part Name: 4.7kΩ ±1% 62.5mW 厚膜电阻; Supplier Part: C25900; Manufacturer: UNI-ROYAL(厚声); Supplier Footprint: 0402; JLCPCB Part Class: 基础库; Datasheet: https://atta.szlcsc.com/upload/public/pdf/source/20200306/C422600_1E6D84923E4A46A82E41ADD87F860B5C.pdf; Supplier: LCSC; Type: 厚膜电阻; Tolerance: ±1%; Power(Watts): 62.5mW; Overload Voltage (Max): 50V; Temperature Coefficient: ±100ppm/℃; Operating Temperature Range: -55℃~+155℃
R110 R111 R196 = 0402WGF1002TCE: 电阻类型:厚膜电阻;阻值:10kΩ;精度:±1%;功率:62.5mW;; LCSC Part Name: 10kΩ ±1% 62.5mW; Supplier Part: C25744; Manufacturer: UNI-ROYAL(厚声); Supplier Footprint: 0402; JLCPCB Part Class: Basic Part; Datasheet: https://atta.szlcsc.com/upload/public/pdf/source/20200306/C422600_1E6D84923E4A46A82E41ADD87F860B5C.pdf; Supplier: LCSC; Type: 厚膜电阻; Tolerance: ±1%; Power(Watts): 62.5mW; Temperature Coefficient: ±100ppm/; Overload Voltage (Max): 50V; Operating Temperature Range: -55~+155
R128 R129 = 0402WGF750JTCE: 电阻类型:厚膜电阻;阻值:75Ω;精度:±1%;功率:62.5mW;最大工作电压:50V;温度系数:±100ppm/℃;; LCSC Part Name: 75Ω ±1% 62.5mW 厚膜电阻; Supplier Part: C25133; Manufacturer: UNI-ROYAL(厚声); Supplier Footprint: 0402; JLCPCB Part Class: 扩展库; Datasheet: https://atta.szlcsc.com/upload/public/pdf/source/20200306/C422600_1E6D84923E4A46A82E41ADD87F860B5C.pdf; Supplier: LCSC; Type: 厚膜电阻; Tolerance: ±1%; Power(Watts): 62.5mW; Overload Voltage (Max): 50V; Temperature Coefficient: ±100ppm/℃; Operating Temperature Range: -55℃~+155℃
R173 R198 R199 R201 R202 R227 = RC0402FR-0710KL: 电阻类型:厚膜电阻;阻值:10kΩ;精度:±1%;功率:62.5mW;最大工作电压:50V;温度系数:±100ppm/℃;; LCSC Part Name: 厚膜电阻 10kΩ ±1% 62.5mW; Supplier Part: C60490; Manufacturer: YAGEO(国巨); Supplier Footprint: 0402; JLCPCB Part Class: 扩展库; Datasheet: https://atta.szlcsc.com/upload/public/pdf/source/20170925/C131467_1506321478108990263.pdf; Supplier: LCSC; Type: 厚膜电阻; Tolerance: ±1%; Power(Watts): 62.5mW; Overload Voltage (Max): 50V; Temperature Coefficient: ±100ppm/℃; Operating Temperature Range: -55℃~+155℃
U6 = AT7456E: 视频字符叠加芯片，跟MAX7456-pin-pin; Supplier Part: C82351; Manufacturer: 杭州中科微; Supplier Footprint: TSSOP-28; JLCPCB Part Class: 扩展库; Datasheet: https://atta.szlcsc.com/upload/public/pdf/source/20180326/C82351_A40539A53E8345C88178541014FDE5FB.pdf; Supplier: LCSC
U30 U58 = ICM-42688-P: 传感器类型:加速度计陀螺仪;; Supplier Part: C1850418; Manufacturer: TDK InvenSense(应美盛); Supplier Footprint: LGA-14(2.5x3); JLCPCB Part Class: 扩展库; Datasheet: https://atta.szlcsc.com/upload/public/pdf/source/20210703/CF24204867ACE5B754A2B035F23E5931.pdf; Supplier: LCSC; Sensor Type: 加速度计陀螺仪
U37 = IST8310: Supplier Part: C9900047266; Supplier Footprint: LGA-16; Supplier: LCSC; NO_CONNECT: yes
U38 U67 = TJA1051TK/3/1J: Supplier Part: C2875699; Manufacturer: NXP(恩智浦); Supplier Footprint: HVSON-8-EP(3x3); JLCPCB Part Class: 扩展库; Datasheet: https://atta.szlcsc.com/upload/public/pdf/source/20210128/C2671135_A82E49CDEFC20634F2534E8F261E286A.pdf; Supplier: LCSC
U59 = MS560702BA03-50: 压力范围:1Kpa~120Kpa;; LCSC Part Name: MS5607-02BA03; Supplier Part: C97627; Manufacturer: TE Connectivity(泰科电子); Supplier Footprint: SMD-8P; JLCPCB Part Class: 扩展库; Datasheet: https://atta.szlcsc.com/upload/public/pdf/source/20201028/C97627_D1AD84A125C98F016158FE88325F3F1E.pdf; Supplier: LCSC; Pressure range: 1Kpa~120Kpa; The Power Supply Voltage: 1.8V~3.6V; Operating Temperature: -40℃~+85℃
X3 = TAXM24M4ZDBCCT2T: 频率:24MHz;频率公差:±20ppm;负载电容:10pF;; LCSC Part Name: 24MHz ±20ppm 内置负载电容:10pF; Supplier Part: C5210654; Manufacturer: TAE(雅晶鑫); Supplier Footprint: SMD2016-4P; Datasheet: https://atta.szlcsc.com/upload/public/pdf/source/20190419/C388793_192353B16CD053644393BCEECA40F8D0.pdf; Supplier: LCSC; Crystal Type: 贴片无源晶振; Frequency Tolerance: ±20ppm; Frequency Stability: ±15ppm; Load Capacitance: 10pF; Equivalent Series Resistance (ESR): 80Ω
C150 C152 C156 C158 = CL10A226MO7JZNC: 容值:22uF;精度:±20%;额定电压:16V;材质(温度系数):X5R;; LCSC Part Name: 22uF ±20% 16V; Supplier Part: C2762594; Manufacturer: SAMSUNG(三星); Supplier Footprint: 0603; JLCPCB Part Class: 扩展库; Datasheet: https://atta.szlcsc.com/upload/public/pdf/source/20220811/0832C3B1C642040B023B7A6186895861.pdf; Supplier: LCSC; Tolerance: ±20%; Voltage Rated: 16V; Temperature Coefficient: X5R
C151 C157 = CL10A106MA8NRNC: 容值:10uF;精度:±20%;额定电压:25V;材质(温度系数):X5R;; LCSC Part Name: 10uF ±20% 25V; Supplier Part: C96446; Manufacturer: SAMSUNG(三星); Supplier Footprint: 0603; JLCPCB Part Class: 基础库; Datasheet: https://atta.szlcsc.com/upload/public/pdf/source/20160218/1457707763339.pdf; Supplier: LCSC; Tolerance: ±20%; Voltage Rated: 25V; Temperature Coefficient: X5R
C153-C155 C159 C165 C171 = GRM155R71H104KE14D: 容值:100nF;精度:±10%;额定电压:50V;材质(温度系数):X7R;; LCSC Part Name: 100nF ±10% 50V; Supplier Part: C77020; Manufacturer: muRata(村田); Supplier Footprint: 0402; JLCPCB Part Class: 扩展库; Datasheet: https://atta.szlcsc.com/upload/public/pdf/source/20180326/C77020_39BD49C951FF1AF0DB1F1FAC5AC1E401.pdf; Supplier: LCSC; Tolerance: ±10%; Voltage Rated: 50V; Temperature Coefficient: X7R
C160 C161 C166 C167 = CM316X7S475K100AT: 容值:4.7uF;精度:±10%;额定电压:100V;材质(温度系数):X7S;; LCSC Part Name: 4.7uF ±10% 100V; Supplier Part: C2900750; Manufacturer: Kyocera AVX; Supplier Footprint: 1206; JLCPCB Part Class: 扩展库; Datasheet: https://atta.szlcsc.com/upload/public/pdf/source/20211011/AE4197305F3E2EABD31E9F5C54B7CCB5.pdf; Supplier: LCSC; Tolerance: ±10%; Voltage Rated: 100V; Temperature Coefficient: X7S
C162 C168 = 0402B331K500NT: 容值:330pF;精度:±10%;额定电压:50V;材质(温度系数):X7R;; LCSC Part Name: 330pF ±10% 50V; Supplier Part: C1535; Manufacturer: FH(风华); Supplier Footprint: 0402; JLCPCB Part Class: 扩展库; Datasheet: https://atta.szlcsc.com/upload/public/pdf/source/20200305/C486355_26A10D38EF8C2A5C37091D0039909270.pdf; Supplier: LCSC; Tolerance: ±10%; Voltage Rated: 50V; Temperature Coefficient: X7R
C163 C164 C169 C170 = C3216X5R1E336MT000E: 容值:33uF;精度:±20%;额定电压:25V;材质(温度系数):X5R;; LCSC Part Name: 33uF ±20% 25V; Supplier Part: C342307; Manufacturer: TDK; Supplier Footprint: 1206; JLCPCB Part Class: 扩展库; Datasheet: https://atta.szlcsc.com/upload/public/pdf/source/20190612/C361180_85CC9FB0751BEA97238DE56AB4AF0B1F.pdf; Supplier: LCSC; Tolerance: ±20%; Voltage Rated: 25V; Temperature Coefficient: X5R
D2 = SMAJ33A: 极性:单向;反向截止电压(Vrwm):33V;击穿电压:36.7V;反向漏电流(Ir):5uA;峰值脉冲电流(Ipp)@10/1000s:7.5A;最大钳位电压:53.3V;; LCSC Part Name: 单向 Vrwm:33V; Supplier Part: C143131; Manufacturer: FMS(美丽微); Supplier Footprint: SMA(DO-214AC); JLCPCB Part Class: 扩展库; Datasheet: https://atta.szlcsc.com/upload/public/pdf/source/20171109/C143131_15102200967431103682.pdf; Supplier: LCSC; Polarity: 单向; Reverse Stand-Off Voltage (Vrwm): 33V; Breakdown Voltage: 36.7V; Reverse Leakage Current (Ir): 5uA; Peak Pulse Current (Ipp)@10/1000μs: 7.5A; Maximum Clamping Voltage: 53.3V
D6 D7 = SS310_C15874: 正向压降(Vf):850mV@3A;直流反向耐压(Vr):100V;平均整流电流(Io):3A;; LCSC Part Name: 电压:100V 电流:3A; Supplier Part: C15874; Manufacturer: MDD; Supplier Footprint: SMA(DO-214AC); JLCPCB Part Class: 扩展库; Datasheet: https://atta.szlcsc.com/upload/public/pdf/source/20230314/A80AE34493C69B89E2F4B1712F433538.pdf; Supplier: LCSC; Forward Voltage (Vf@If): 850mV@3A; Reverse Voltage (Vr): 100V; Average Rectified Current (Io): 3A; Reverse Leakage Current (Ir): 500uA@100V
L8 L9 = FXL0420-100-M: 类型:一体成型电感;电感值:10uH;精度:±20%;额定电流:1.6A;饱和电流(Isat):2.2A;; LCSC Part Name: 10uH ±20% 2.2A; Supplier Part: C177242; Manufacturer: cjiang(长江微电); Supplier Footprint: SMD,4.2x4.4mm; JLCPCB Part Class: Extended Part; Datasheet: https://atta.szlcsc.com/upload/public/pdf/source/20200117/C485363_A2440626DC7482D75DD0DD56D1883FBF.pdf; Supplier: LCSC; Type: 一体成型电感; Tolerance: ±20%; Rated Current: 1.6A; Saturation Current (Isat): 2.2A; DC Resistance (DCR): 282mΩ
R197 R200 = 0402WGF2201TCE: 电阻类型:厚膜电阻;阻值:2.2kΩ;精度:±1%;功率:62.5mW;最大工作电压:50V;温度系数:±100ppm/℃;; LCSC Part Name: 2.2kΩ ±1% 62.5mW 厚膜电阻; Supplier Part: C25879; Manufacturer: UNI-ROYAL(厚声); Supplier Footprint: 0402; JLCPCB Part Class: 基础库; Datasheet: https://atta.szlcsc.com/upload/public/pdf/source/20200306/C422600_1E6D84923E4A46A82E41ADD87F860B5C.pdf; Supplier: LCSC; Type: 厚膜电阻; Tolerance: ±1%; Power(Watts): 62.5mW; Overload Voltage (Max): 50V; Temperature Coefficient: ±100ppm/℃; Operating Temperature Range: -55℃~+155℃
R203 R210 = 0402WGF1742TCE: 电阻类型:厚膜电阻;阻值:17.4kΩ;精度:±1%;功率:62.5mW;最大工作电压:50V;温度系数:±100ppm/℃;; LCSC Part Name: 17.4kΩ ±1% 62.5mW 厚膜电阻; Supplier Part: C26957; Manufacturer: UNI-ROYAL(厚声); Supplier Footprint: 0402; JLCPCB Part Class: 扩展库; Datasheet: https://atta.szlcsc.com/upload/public/pdf/source/20200306/C422600_1E6D84923E4A46A82E41ADD87F860B5C.pdf; Supplier: LCSC; Type: 厚膜电阻; Tolerance: ±1%; Power(Watts): 62.5mW; Overload Voltage (Max): 50V; Temperature Coefficient: ±100ppm/℃; Operating Temperature Range: -55℃~+155℃
R204 R211 = 0402WGF1004TCE: 电阻类型:厚膜电阻;阻值:1MΩ;精度:±1%;功率:62.5mW;最大工作电压:50V;温度系数:±100ppm/℃;; LCSC Part Name: 1MΩ ±1% 62.5mW 厚膜电阻; Supplier Part: C26083; Manufacturer: UNI-ROYAL(厚声); Supplier Footprint: 0402; JLCPCB Part Class: 基础库; Datasheet: https://atta.szlcsc.com/upload/public/pdf/source/20200306/C422600_1E6D84923E4A46A82E41ADD87F860B5C.pdf; Supplier: LCSC; Type: 厚膜电阻; Tolerance: ±1%; Power(Watts): 62.5mW; Overload Voltage (Max): 50V; Temperature Coefficient: ±100ppm/℃; Operating Temperature Range: -55℃~+155℃
R206 R213 = 0402WGF4752TCE: 电阻类型:厚膜电阻;阻值:47.5kΩ;精度:±1%;功率:62.5mW;最大工作电压:50V;温度系数:±100ppm/℃;; LCSC Part Name: 47.5kΩ ±1% 62.5mW 厚膜电阻; Supplier Part: C25896; Manufacturer: UNI-ROYAL(厚声); Supplier Footprint: 0402; JLCPCB Part Class: 扩展库; Datasheet: https://atta.szlcsc.com/upload/public/pdf/source/20200306/C422600_1E6D84923E4A46A82E41ADD87F860B5C.pdf; Supplier: LCSC; Type: 厚膜电阻; Tolerance: ±1%; Power(Watts): 62.5mW; Overload Voltage (Max): 50V; Temperature Coefficient: ±100ppm/℃; Operating Temperature Range: -55℃~+155℃
R207 R214 = 0402WGF4022TCE: 电阻类型:厚膜电阻;阻值:40.2kΩ;精度:±1%;功率:62.5mW;最大工作电压:50V;温度系数:±100ppm/℃;; LCSC Part Name: 40.2kΩ ±1% 62.5mW 厚膜电阻; Supplier Part: C25893; Manufacturer: UNI-ROYAL(厚声); Supplier Footprint: 0402; JLCPCB Part Class: 扩展库; Datasheet: https://atta.szlcsc.com/upload/public/pdf/source/20200306/C422600_1E6D84923E4A46A82E41ADD87F860B5C.pdf; Supplier: LCSC; Type: 厚膜电阻; Tolerance: ±1%; Power(Watts): 62.5mW; Overload Voltage (Max): 50V; Temperature Coefficient: ±100ppm/℃; Operating Temperature Range: -55℃~+155℃
R209 R216 = 0402WGF200JTCE: 电阻类型:厚膜电阻;阻值:20Ω;精度:±1%;功率:62.5mW;最大工作电压:50V;温度系数:±200ppm/℃;; LCSC Part Name: 20Ω ±1% 62.5mW 厚膜电阻; Supplier Part: C25089; Manufacturer: UNI-ROYAL(厚声); Supplier Footprint: 0402; JLCPCB Part Class: 扩展库; Datasheet: https://atta.szlcsc.com/upload/public/pdf/source/20200306/C422600_1E6D84923E4A46A82E41ADD87F860B5C.pdf; Supplier: LCSC; Type: 厚膜电阻; Tolerance: ±1%; Power(Watts): 62.5mW; Overload Voltage (Max): 50V; Temperature Coefficient: ±200ppm/℃; Operating Temperature Range: -55℃~+155℃
R219 = RC0402FR-07560KL: 电阻类型:厚膜电阻;阻值:560kΩ;精度:±1%;功率:62.5mW;最大工作电压:50V;温度系数:±100ppm/℃;; LCSC Part Name: 厚膜电阻 560kΩ ±1% 62.5mW; Supplier Part: C137958; Manufacturer: YAGEO(国巨); Supplier Footprint: 0402; JLCPCB Part Class: 扩展库; Datasheet: https://atta.szlcsc.com/upload/public/pdf/source/20181009/C309620_DA5935B6E1D48212CB7A533FE518B3C2.pdf; Supplier: LCSC; Type: 厚膜电阻; Tolerance: ±1%; Power(Watts): 62.5mW; Overload Voltage (Max): 50V; Temperature Coefficient: ±100ppm/℃; Operating Temperature Range: -55℃~+155℃
R220 = 0402WGF2203TCE: 电阻类型:厚膜电阻;阻值:220kΩ;精度:±1%;功率:62.5mW;最大工作电压:50V;温度系数:±100ppm/℃;; LCSC Part Name: 220kΩ ±1% 62.5mW 厚膜电阻; Supplier Part: C25767; Manufacturer: UNI-ROYAL(厚声); Supplier Footprint: 0402; JLCPCB Part Class: 扩展库; Datasheet: https://atta.szlcsc.com/upload/public/pdf/source/20200306/C422600_1E6D84923E4A46A82E41ADD87F860B5C.pdf; Supplier: LCSC; Type: 厚膜电阻; Tolerance: ±1%; Power(Watts): 62.5mW; Overload Voltage (Max): 50V; Temperature Coefficient: ±100ppm/℃; Operating Temperature Range: -55℃~+155℃
R221 R222 = 0402WGF2003TCE: 电阻类型:厚膜电阻;阻值:200kΩ;精度:±1%;功率:62.5mW;最大工作电压:50V;温度系数:±100ppm/℃;; LCSC Part Name: 200kΩ ±1% 62.5mW 厚膜电阻; Supplier Part: C25764; Manufacturer: UNI-ROYAL(厚声); Supplier Footprint: 0402; JLCPCB Part Class: 基础库; Datasheet: https://atta.szlcsc.com/upload/public/pdf/source/20200306/C422600_1E6D84923E4A46A82E41ADD87F860B5C.pdf; Supplier: LCSC; Type: 厚膜电阻; Tolerance: ±1%; Power(Watts): 62.5mW; Overload Voltage (Max): 50V; Temperature Coefficient: ±100ppm/℃; Operating Temperature Range: -55℃~+155℃
U98 U204 = LP5912-3.3DRVT: 输出类型:固定;最大输入电压:6.5V;输出电压:3.3V;最大输出电流:500mA;电源纹波抑制比(PSRR):40dB@(100kHz);输出极性:正极;; LCSC Part Name: 输入6.5V 输出3.3V 500mA; Supplier Part: C134121; Manufacturer: TI(德州仪器); Supplier Footprint: WSON-6-EP(2x2); JLCPCB Part Class: 扩展库; Datasheet: https://www.ti.com/cn/lit/gpn/lp5912; Supplier: LCSC; Output Type: 固定; Maximum Input Voltage: 6.5V; Output Voltage: 3.3V; MAX Output Current: 500mA; Power Supply Rejection Ratio (PSRR): 40dB@(100kHz); Dropout Voltage: 250mV@(500mA); standby current: 55uA; Operating Temperature: -40℃~+125℃@(Tj); Output Polarity: 正极; Number of Outputs: 1
U205 U206 = MP4560DQ
R133-R140 R174-R183 R186-R189 R192-R195 R225 R226 = 0402WGF1000TCE: 电阻类型:厚膜电阻;阻值:100Ω;精度:±1%;功率:62.5mW;最大工作电压:50V;温度系数:±200ppm/℃;; LCSC Part Name: 100Ω ±1% 62.5mW 厚膜电阻; Supplier Part: C25076; Manufacturer: UNI-ROYAL(厚声); Supplier Footprint: 0402; JLCPCB Part Class: 基础库; Datasheet: https://atta.szlcsc.com/upload/public/pdf/source/20200306/C422600_1E6D84923E4A46A82E41ADD87F860B5C.pdf; Supplier: LCSC; Type: 厚膜电阻; Tolerance: ±1%; Power(Watts): 62.5mW; Overload Voltage (Max): 50V; Temperature Coefficient: ±200ppm/℃; Operating Temperature Range: -55℃~+155℃
U60 = ZX-SH1.0-6PWT: 插针结构:1x6P;间距:1mm;安装方式:卧贴;参考系列:SH;总PIN数:6P;排数:1;每排PIN数:6;行距:-;额定电流:1A;触头材质:黄铜;触头镀层:锡;工作温度范围:-25℃~+85℃;; Supplier Part: C7430448; Manufacturer: Megastar(兆星); Supplier Footprint: SMD,P=1mm,卧贴; JLCPCB Part Class: 扩展库; Datasheet: https://atta.szlcsc.com/upload/public/pdf/source/20230619/677B156B919545DC550B043554513491.pdf; Supplier: LCSC; Pins Structure: 1x6P; Pitch: 1mm; Mounting Style: 卧贴; Reference Series: SH; Number of Pins: 6P; Number of Rows: 1; Number of PINs Per Row: 6; Current Rating (Max): 1A; Contact Material: 黄铜; Contact Plating: 锡; Operating Temperature Range: -25℃~+85℃
U70 = ZX-SH1.0-8PWT: 插针结构:1x8P;间距:1mm;安装方式:卧贴;参考系列:SH;总PIN数:8P;排数:1;每排PIN数:8;行距:-;额定电流:1A;触头材质:黄铜;触头镀层:锡;工作温度范围:-25℃~+85℃;; Supplier Part: C7430450; Manufacturer: Megastar(兆星); Supplier Footprint: SMD,P=1mm,卧贴; JLCPCB Part Class: 扩展库; Datasheet: https://atta.szlcsc.com/upload/public/pdf/source/20230619/1B6A23D99AB40A01DBAA7D7AE5A01F3F.pdf; Supplier: LCSC; Pins Structure: 1x8P; Pitch: 1mm; Mounting Style: 卧贴; Reference Series: SH; Number of Pins: 8P; Number of Rows: 1; Number of PINs Per Row: 8; Current Rating (Max): 1A; Contact Material: 黄铜; Contact Plating: 锡; Operating Temperature Range: -25℃~+85℃
U71 = BX-GH1.25-4PWT: 插针结构:1x4P;间距:1.25mm;安装方式:卧贴;参考系列:GH;总PIN数:4P;排数:1;每排PIN数:4;行距:-;额定电流:1A;触头材质:磷铜;触头镀层:锡;工作温度范围:-25℃~+85℃;; Supplier Part: C18077720; Manufacturer: Bossie(博锡); Supplier Footprint: SMD,P=1.25mm,卧贴; JLCPCB Part Class: 扩展库; Datasheet: https://atta.szlcsc.com/upload/public/pdf/source/20231017/B66D9CA4205922AD4D2D93130B005F0C.pdf; Supplier: LCSC; Pins Structure: 1x4P; Pitch: 1.25mm; Mounting Style: 卧贴; Reference Series: GH; Number of Pins: 4P; Number of Rows: 1; Number of PINs Per Row: 4; Current Rating (Max): 1A; Contact Material: 磷铜; Contact Plating: 锡; Operating Temperature Range: -25℃~+85℃
U106 U114-U118 U121-U124 U127-U203 = 焊盘原件
U119 U120 U125 U126 = ZX-GH1.25-WT6: 插针结构:1x6P;间距:1.25mm;安装方式:卧贴;参考系列:GH;总PIN数:6P;排数:1;每排PIN数:6;行距:-;额定电流:1A;触头材质:磷铜;触头镀层:锡;工作温度范围:-25℃~+85℃;; Supplier Part: C7429519; Manufacturer: Megastar(兆星); Supplier Footprint: SMD,P=1.25mm,卧贴; JLCPCB Part Class: 扩展库; Datasheet: https://atta.szlcsc.com/upload/public/pdf/source/20230619/C65AC723A8B8014806519FCCDC589EDA.pdf; Supplier: LCSC; Pins Structure: 1x6P; Pitch: 1.25mm; Mounting Style: 卧贴; Reference Series: GH; Number of Pins: 6P; Number of Rows: 1; Number of PINs Per Row: 6; Current Rating (Max): 1A; Contact Material: 磷铜; Contact Plating: 锡; Operating Temperature Range: -25℃~+85℃

## Nets
3V3_ADC: U65.H4(PC5) U160.1
3V3_IMU: C32.2 C114.2 C115.2 C135.2 C136.2 C137.2 C138.2 C157.2 C158.1 C159.2 L3.2 R173.2 R202.2 R227.2 U30.5(VDDIO) U30.8(VDD) U58.5(VDDIO) U58.8(VDD) U59.1(VDD) U204.1(OUT)
GND: C22.1 C23.1 C24.1 C25.1 C26.1 C27.1 C32.1 C82.1 C83.1 C84.2 C85.1 C89.1 C90.1 C102.2 C114.1 C115.1 C117.1 C118.1 C119.1 C121.2 C122.2 C123.2 C135.1 C136.1 C137.1 C138.1 C146.1 C147.1 C150.2 C151.1 C152.2 C153.1 C154.1 C155.1 C156.2 C157.1 C158.2 C159.1 C160.1 C161.1 C163.1 C164.1 C166.1 C167.1 C169.1 C170.1 CARD4.6(VSS) CARD4.9 CARD4.10 CARD4.11(EH) D2.2(A) D6.2(A) D7.2(A) LED6.1(K) LED7.1(K) LED8.1(K) Q4.2(E) R99.1 R100.1 R108.1 R118.1 R129.1 R171.2 R197.1 R200.1 R203.1 R206.1 R207.1 R210.1 R213.1 R214.1 R221.1 R222.1 U6.4(DGND) U6.20(AGND) U6.23(PGND) U6.29(EP) U30.6(GND) U30.7(RESV) U30.9(INT2/FSYNC/CLKIN) U37.5(CAD0) U37.9(VSS) U37.11(VSS) U38.2(GND) U38.9(EP) U58.6(GND) U58.7(RESV) U58.9(INT2/FSYNC/CLKIN) U59.2(PS) U59.3(GND) U60.1 U60.7 U60.8 U65.C2(VSS) U65.E4(VSS) U65.E5(VSS) U65.E6(VSS) U65.G1(VSSA) U65.J1(VSS) U67.2(GND) U67.9(EP) U70.1 U70.9 U70.10 U71.4 U71.5 U71.6 U98.5(GND) U98.7(EP) U115.1 U119.6 U119.7 U119.8 U120.6 U120.7 U120.8 U125.6 U125.7 U125.8 U126.6 U126.7 U126.8 U129.1 U133.1 U137.1 U141.1 U145.1 U148.1 U159.1 U163.1 U165.1 U173.1 U179.1 U183.1 U186.1 U188.1 U193.1 U201.1 U203.1 U204.5(GND) U204.7(EP) U205.6(GND) U205.EPAD U206.6(GND) U206.EPAD USB1.13(GND) USB1.14(GND) USB1.15(GND) USB1.16(GND) USB1.A1B12(GND) USB1.B1A12(GND) X2.2(GND) X3.2(GND) X3.4(GND)
VBAT: C160.2 C161.2 C166.2 C167.2 D2.1(K) R170.2 R204.2 R211.2 U60.2 U70.2 U147.1 U192.1 U205.8(VIN) U205.9(VIN) U206.8(VIN) U206.9(VIN)
VBAT_ADC: C82.2 R170.1 R171.1 U65.F1(PC0)
VBUS_SENSING: R118.2 R119.2 U65.G6(PE10)
VDD_5V_IN: C121.1 C122.1 C123.1 C146.2 C147.2 C150.1 C154.2 C155.2 C156.1 D4.1(K) D5.1(K) R130.2 R131.1 R143.1 R197.2 R198.2 R200.2 R201.2 U6.3(DVDD) U6.21(AVDD) U6.24(PVDD) U38.3(VCC) U67.3(VCC) U71.1 U98.6(IN) U114.1 U119.1 U120.1 U125.1 U126.1 U128.1 U132.1 U136.1 U140.1 U144.1 U162.1 U164.1 U172.1 U178.1 U182.1 U185.1 U189.1 U194.1 U200.1 U204.6(IN)
AWG3V3: C118.2 C119.2 L3.1 R76.2 R88.2 R126.2 U37.2(AVDD) U37.13(DVDD)
BEC_5V: C163.2 C164.2 D5.2(A) L8.2 R220.2
BEC_12V: C169.2 C170.2 L9.2 R219.2 U157.1 U195.1
BOOT0: R108.2 SW3.3 SW3.4 U65.D5(BOOT0)
BUERZZ: R228.1 U65.H8(PD14)
BZ: Q4.3(C) U184.1
CAD1: R126.1 U37.6(CAD1)
CAM: C120.1 R129.2 U158.1
CAN1_H: R56.2 U38.7(CANH) U71.3
CAN1_L: R56.1 U38.6(CANL) U71.2
CAN1_RX: U38.4(RXD) U65.D8(PD0)
CAN1_TX: U38.1(TXD) U65.A4(PB9)
CAN2_H: R172.2 U67.7(CANH) U127.1
CAN2_L: R172.1 U67.6(CANL) U130.1
CAN2_RX: U65.C5(PB5) U67.4(RXD)
CAN2_TX: U65.J8(PB13) U67.1(TXD)
CC1: R99.2 USB1.A5(CC1)
CC2: R100.2 USB1.B5(CC2)
CURR_ADC: U65.F2(PC1) U70.8
D+: R101.1 USB1.A6(DP1) USB1.B6(DP2)
D-: R102.1 USB1.A7(DN1) USB1.B7(DN2)
GPIO_CAN1_SILENT: R227.1 U38.8(S) U65.B3(PE3)
GPIO_CAN2_SILENT: R173.1 U65.H7(PE15) U67.8(S)
I2C1_SCL: R76.1 U37.1(SCL) U65.B4(PB8) U199.1
I2C1_SDA: R88.1 U37.16(SDA) U65.A5(PB7) U202.1
I2C2_SCL: R191.1 R192.1 U65.J7(PB10)
I2C2_SCL_GPS2: R192.2 U126.4 U180.1
I2C2_SDA: R190.1 R193.1 U65.K7(PB11)
I2C2_SDA_GPS2: R193.2 U126.5 U181.1
I2C3_SCL: R185.1 R186.1 U65.D9(PA8)
I2C3_SCL_GPS2: R186.2 U125.4 U174.1
I2C3_SDA: R184.1 R187.1 U65.E9(PC9)
I2C3_SDA_GPS2: R187.2 U125.5 U175.1
I2C4_SCL: R224.1 R225.1 U65.K10(PD12)
I2C4_SCL_PORT: R225.2 U143.1
I2C4_SDA: R223.1 R226.1 U65.J10(PD13)
I2C4_SDA_PORT: R226.2 U146.1
INT_1: U58.4(INT1/INT) U65.H9(PD10)
INT_2: U30.4(INT1/INT) U65.G8(PD15)
LED1: R229.1 U65.A1(PC14-OSC32_IN)
LED2: R230.1 U65.A2(PC13)
MCU_3V3: C22.2 C23.2 C24.2 C25.2 C26.2 C27.2 C151.2 C152.1 C153.2 CARD4.4(VDD) R109.2 R110.1 R111.1 R184.2 R185.2 R190.2 R191.2 R196.1 R199.2 R223.2 R224.2 SW3.1 SW3.2 U38.5(VIO) U65.B2(VBAT) U65.D2(VDD) U65.F4(VDDLDO) U65.F5(VDD) U65.F6(33USB) U65.F7(PDR_ON) U65.H1(VDDA) U65.K1(VDD) U67.5(VIO) U98.1(OUT)
MCU_OSC_IN: C84.1 U65.C1(PHO-OSC_IN) X2.3(OSC2)
MCU_OSC_OUT: C85.2 U65.D1(PH1-OSC_OUT) X2.1(OSC1)
NRST: C83.2 R109.1 U65.E1(NRST)
OSD_OSC_IN: U6.5(CLKIN) X3.1(OSC1)
OSD_OSC_OUT: U6.6(XFB) X3.3(OSC2)
OUT1: R133.2 U70.3 U150.1
OUT2: R134.2 U70.4 U149.1
OUT3: R135.2 U70.5 U152.1
OUT4: R136.2 U70.6 U151.1
OUT5: R137.2 U60.3 U154.1
OUT6: R138.2 U60.4 U153.1
OUT7: R139.2 U60.5 U156.1
OUT8: R140.2 U60.6 U155.1
OUT9: R174.2 U118.1
OUT10: R175.2 U117.1
RSSI_ADC: U65.G4(PC4) U161.1
S1: R133.1 U65.G2(PA0)
S2: R134.1 U65.J2(PA2)
S3: R135.1 U65.J3(PA6)
S4: R136.1 U65.K2(PA3)
S5: R137.1 U65.K3(PA7)
S6: R138.1 U65.K4(PB1)
S7: R139.1 U65.K5(PE9)
S8: R140.1 U65.G7(PE14)
S9: R174.1 U65.F9(PC8)
S10: R175.1 U65.D10(PA10)
SPI1_MISO: U58.1(AP_SDO/AP_AD0) U65.A6(PB4)
SPI1_MOSI: U58.14(AP_SDA/AP_SDIO/AP_SDI) U65.D6(PD7)
SPI1_NSS: U58.12(AP_CS) U65.A8(PA15)
SPI1_SCK: U58.13(AP_SCL/AP_SCLK) U65.H3(PA5)
SPI2_MISO: CARD4.7(DAT0) R111.2 U65.E2(PC2_C)
SPI2_MOIS: CARD4.3(CMD) U65.F3(PC3_C)
SPI2_NSS: CARD4.2(CD/DAT3) R110.2 U65.K8(PB12)
SPI2_SCK: CARD4.5(CLK) R196.2 U65.C9(PA9)
SPI3_MISO: U6.11(SDOUT) U65.B8(PC11)
SPI3_MOIS: U6.9(SDIN) U65.G5(PB2)
SPI3_NSS: R130.1 U6.8(CS#) U65.G3(PA4)
SPI3_SCK: U6.10(SCLK) U65.B9(PC10)
SPI4_MISO: U30.1(AP_SDO/AP_AD0) U59.6(SDO) U65.D3(PE5)
SPI4_MOSI: U30.14(AP_SDA/AP_SDIO/AP_SDI) U59.7(SDI/SDA) U65.E3(PE6)
SPI4_NSS_1: U30.12(AP_CS) U65.C3(PE4)
SPI4_NSS_2: U59.5(CSB) U65.H6(PE11)
SPI4_SCK: U30.13(AP_SCL/AP_SCLK) U59.8(SCLK) U65.A3(PE2)
SWCLK: U65.A9(PA14) U190.1
SWDIO: U65.A10(PA13) U191.1
TELEM1_CTS: R179.2 U119.5 U167.1
TELEM1_RTS: R178.2 U119.4 U166.1
TELEM1_RX: R177.2 U119.3 U122.1
TELEM1_TX: R176.2 U119.2 U121.1
TELEM2_CTS: R183.2 U120.5 U169.1
TELEM2_RTS: R182.2 U120.4 U168.1
TELEM2_RX: R181.2 U120.3 U124.1
TELEM2_TX: R180.2 U120.2 U123.1
UART4_RX: R189.1 U65.H2(PA1)
UART4_RX_GPS: R189.2 U125.3 U171.1
UART4_TX: R188.1 U65.E8(PD1)
UART4_TX_GPS: R188.2 U125.2 U170.1
UART5_RX: U65.B7(PD2) U116.1
UART5_TX: U65.C8(PC12) U106.1
UART7_RX: U65.H5(PE7) U70.7 U138.1
UART7_TX: U65.J5(PE8) U135.1
UART8_RX: U65.D4(PE0) U134.1
UART8_TX: U65.C4(PE1) U131.1
USART1_RX: R195.1 U65.G10(PB15)
USART1_RX_GPS: R195.2 U126.3 U177.1
USART1_TX: R194.1 U65.B5(PB6)
USART1_TX_GPS: R194.2 U126.2 U176.1
USART2_CTS: R179.1 U65.C7(PD3)
USART2_RTS: R178.1 U65.D7(PD4)
USART2_RX: R177.1 U65.C6(PD6)
USART2_TX: R176.1 U65.B6(PD5)
USART3_CTS: R183.1 U65.G9(PD11)
USART3_RTS: R182.1 U65.H10(PB14)
USART3_RX: R181.1 U65.J9(PD9)
USART3_TX: R180.1 U65.K9(PD8)
USART6_RX: U65.E10(PC7) U142.1
USART6_TX: U65.F10(PC6) U139.1
USB_5V: D4.2(A) R119.1 USB1.A4B9(VBUS) USB1.B4A9(VBUS)
USB_DM: R102.2 U65.C10(PA11) U198.1
USB_DP: R101.2 U65.B10(PA12) U197.1
VCAP1: C89.2 U65.F8(VCAP)
VCAP2: C90.2 U65.E7(VCAP)
VTX: R128.2 U196.1
W2815: U65.A7(PB3) U187.1
$1N4764: LED7.2(A) R229.2
$1N4767: LED6.2(A) R230.2
$1N4769: LED8.2(A) R143.2
$1N23853: Q4.1(B) R228.2
$2N2167: C117.2 U37.14(RSTN)
$2N2170: C102.1 U37.10(C1)
$2N2186: C120.2 U6.22(VIN)
$2N2190: R131.2 U6.19(RESET#)
$2N2216: C133.1 U6.26(VOUT)
$2N2217: C134.1 U6.25(SAG)
$2N2218: C133.2 C134.2 R128.1
$3N7283: R198.1 U98.4(EN)
$3N7287: R199.1 U98.3(PG)
$3N7658: R201.1 U204.4(EN)
$3N7662: R202.1 U204.3(PG)
$3N14872: R203.2 R204.1 U205.3(EN)
$3N16338: R221.2 U205.7(FREQ)
$3N16680: C162.2 U205.4(COMP)
$3N16683: C162.1 R206.2
$3N16889: R207.2 R220.1 U205.5(FB)
$3N17285: R209.1 U205.10(BST)
$3N17287: C165.2 R209.2
$3N17291: C165.1 D6.1(K) L8.1 U205.1(SW) U205.2(SW)
$3N17987: R210.2 R211.1 U206.3(EN)
$3N17988: R222.2 U206.7(FREQ)
$3N17997: C168.2 U206.4(COMP)
$3N17999: C168.1 R213.2
$3N18005: R214.2 R219.1 U206.5(FB)
$3N18017: R216.1 U206.10(BST)
$3N18019: C171.2 R216.2
$3N18021: C171.1 D7.1(K) L9.1 U206.1(SW) U206.2(SW)

Not connected (* = marked no-connect by the designer): CARD4 1(DAT2)* 8(DAT1)*; U6 1(NC)* 2(NC)* 7(CLKOUT)* 12(LOS)* 13(SYNC_IN)* 14(NC)* 15(NC)* 16(NC)* 17(VSYNC#)* 18(HSYNC#)* 27(NC)* 28(NC)*; U30 2(RESV)* 3(RESV)* 10(RESV)* 11(RESV)*; U37 7(VPP)* 15(DRDY)*; U58 2(RESV)* 3(RESV)* 10(RESV)* 11(RESV)*; U59 4(CSB); U65 B1(PC15-OSC32_OUT)* J4(PB0) J6(PE12) K6(PE13); U98 2(NC)*; U204 2(NC)*; USB1 A8(SBU1)* B8(SBU2)*
